# EAGLE design Hornbill  (EAGLE 6.4)
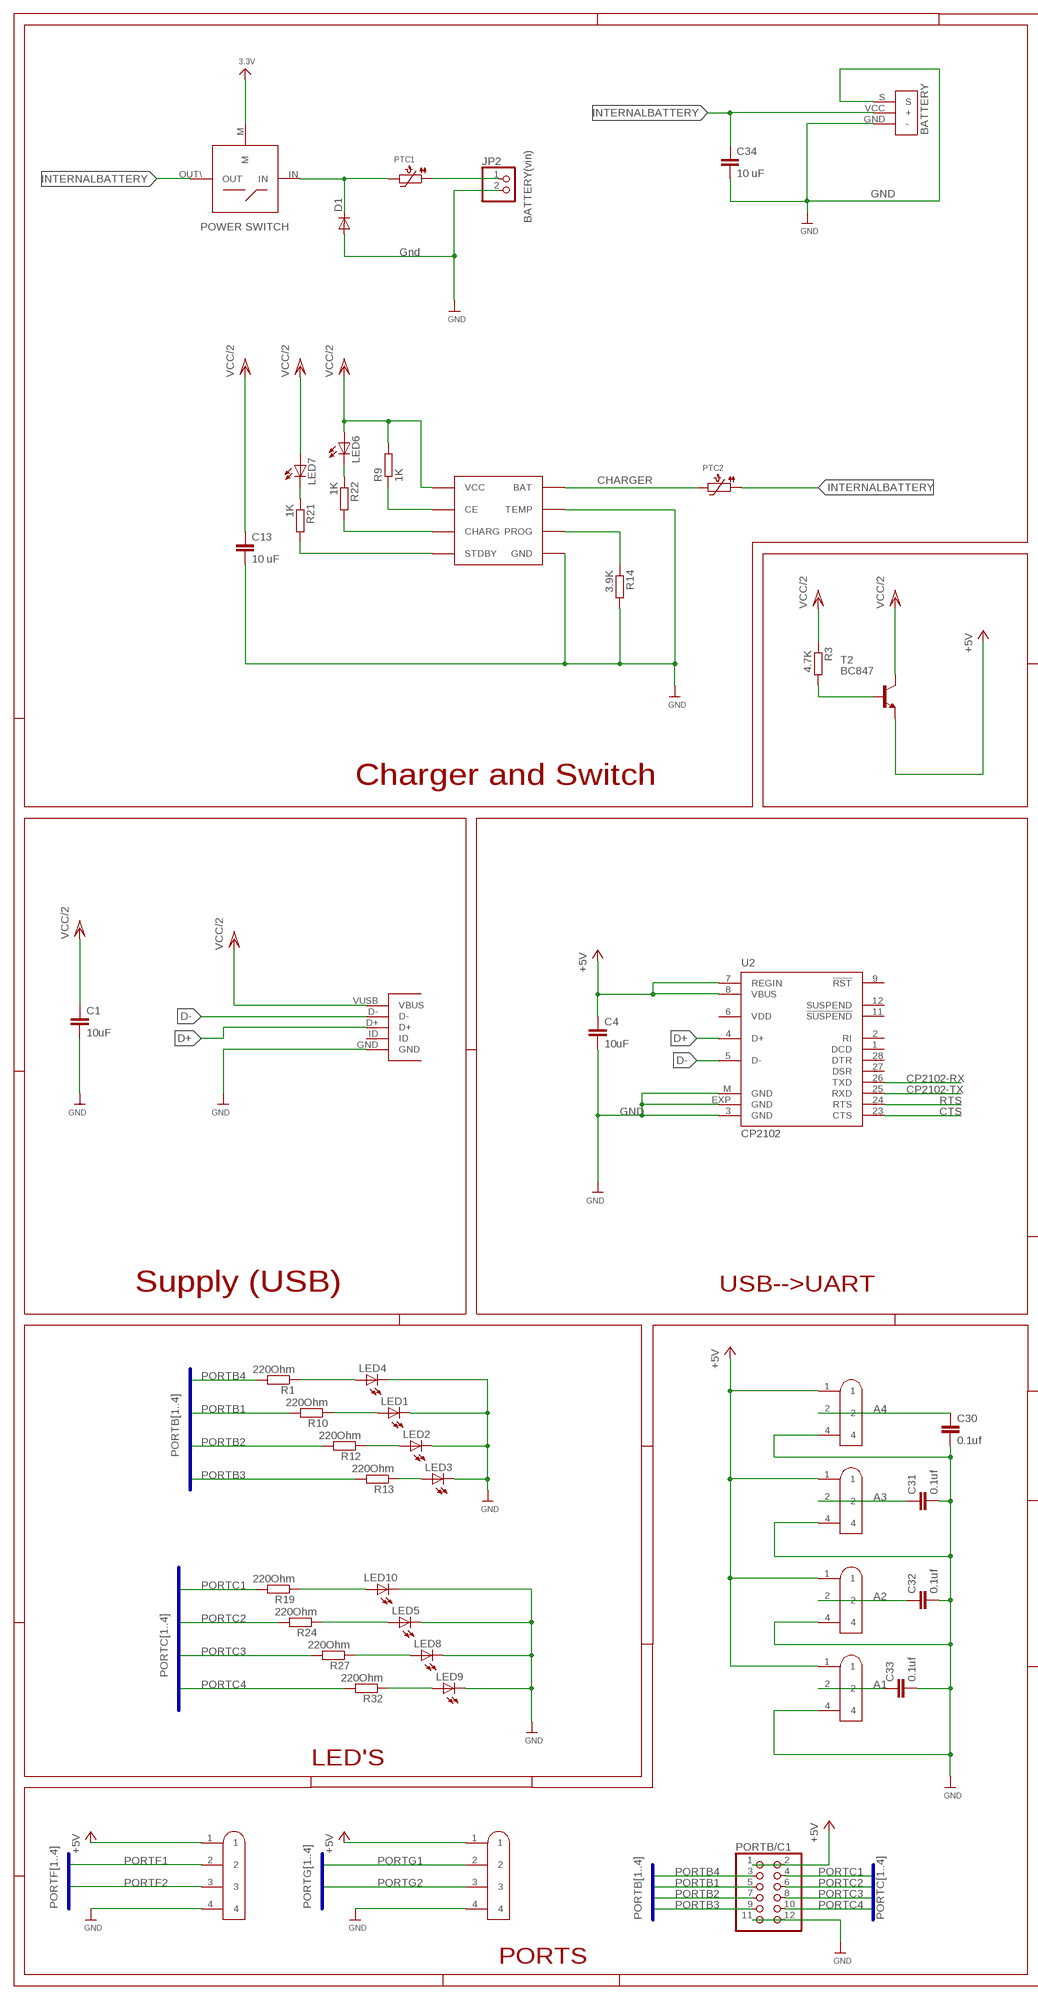
[diagram p0: schematic, sheet 1, part 1 of 2]
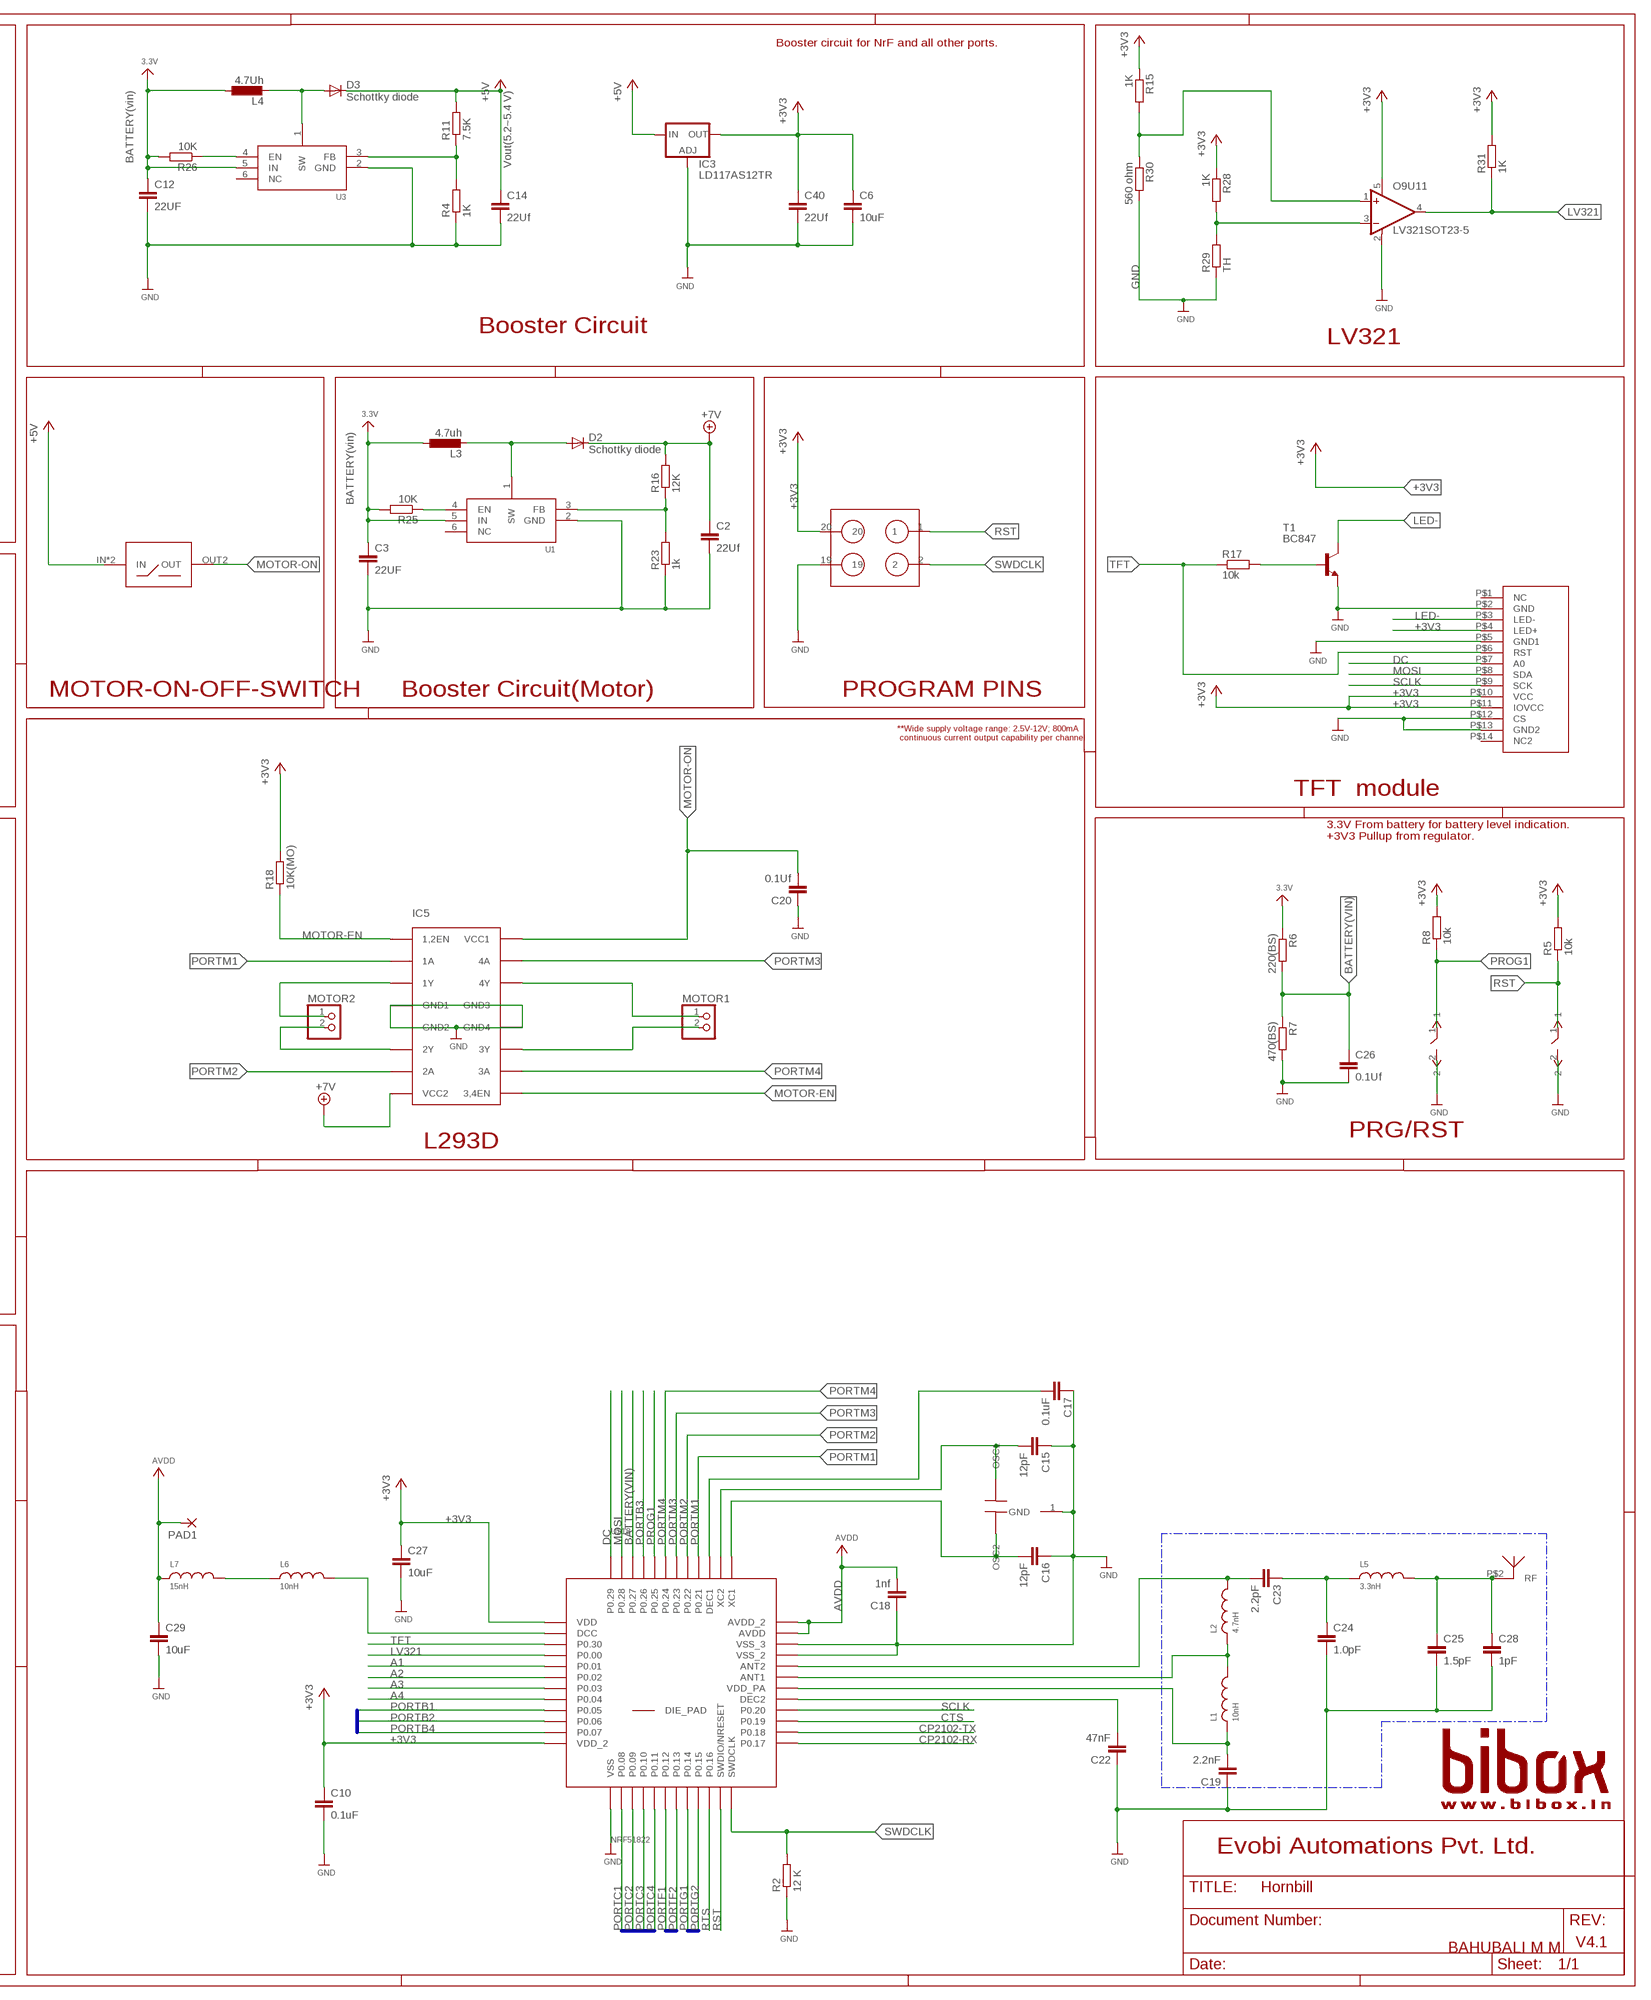
[diagram p1: schematic, sheet 1, part 2 of 2]

## Parts
BATTERY  BS  [BS]
C1  10uF  CAP0603  [0603]
C2  22Uf  C-EUC0603  [C0603]
C3  22UF  C-EUC0603  [C0603]
C4  10uF  CAP0603  [0603]
C6  10uF  C-EUC0603  [C0603]
C10  0.1uF  C-EUC0603  [C0603]
C12  22UF  C-EUC0603  [C0603]
C13  10 uF  C-EUC0603  [C0603]
C14  22Uf  C-EUC0603  [C0603]
C15  12pF  C-EUC0603  [C0603]
C16  12pF  C-EUC0603  [C0603]
C17  0.1uF  C-EUC0603  [C0603]
C18  1nf  C-EUC0603  [C0603]
C19  2.2nF  C-EUC0603  [C0603]
C20  0.1Uf  C-EUC0603  [C0603]
C22  47nF  C-EUC0603  [C0603]
C23  2.2pF  C-EUC0603  [C0603]
C24  1.0pF  C-EUC0603  [C0603]
C25  1.5pF  C-EUC0603  [C0603]
C26  0.1Uf  C-EUC0603  [C0603]
C27  10uF  C-EUC0603  [C0603]
C28  1pF  C-EUC0603  [C0603]
C29  10uF  C-EUC0603  [C0603]
C30  0.1uf  C-EUC0603  [C0603]
C31  0.1uf  C-EUC0603  [C0603]
C32  0.1uf  C-EUC0603  [C0603]
C33  0.1uf  C-EUC0603  [C0603]
C34  10 uF  C-EUC0603  [C0603]
C40  22Uf  C-EUC0603  [C0603]
D1  DIODESMA  [SMA-DIODE]
D2  Schottky diode  DIODESMA  [SMA-DIODE]
D3  Schottky diode  DIODESMA  [SMA-DIODE]
IC2  LT1173CS8  [SOIC8]
IC3  LD117AS12TR  [SOT223]
IC5  L293D  [DIL16]
JP2  PINHD-1X2  [1X02]
L1  10nH  INDUCTOR0603  [0603]
L2  4.7nH  INDUCTOR0603  [0603]
L3  4.7uh  L-EUWE-TPC  [POWER-CHOKE_WE-TPC]
L4  4.7Uh  L-EUWE-TPC  [POWER-CHOKE_WE-TPC]
L5  3.3nH  INDUCTOR0603  [0603]
L6  10nH  INDUCTOR0603  [0603]
L7  15nH  INDUCTOR0603  [0603]
LED1  LEDCHIP-LED0805  [CHIP-LED0805]
LED2  LEDCHIP-LED0805  [CHIP-LED0805]
LED3  LEDCHIP-LED0805  [CHIP-LED0805]
LED4  LEDCHIP-LED0805  [CHIP-LED0805]
LED5  LEDCHIP-LED0805  [CHIP-LED0805]
LED6  LEDCHIP-LED0805  [CHIP-LED0805]
LED7  LEDCHIP-LED0805  [CHIP-LED0805]
LED8  LEDCHIP-LED0805  [CHIP-LED0805]
LED9  LEDCHIP-LED0805  [CHIP-LED0805]
LED10  LEDCHIP-LED0805  [CHIP-LED0805]
MOTOR1  PINHD-1X2  [1X02]
MOTOR2  PINHD-1X2  [1X02]
O9U11  LV321SOT23-5  [SOT23-5]
PAD1  SMD2  [SMD1,27-2,54]
PORTB/C1  PINHD-2X6  [2X06]
PTC1  PTC1206  [1206]
PTC2  PTC1206  [1206]
R1  220Ohm  R-EU_R0603  [R0603]
R2  12 K  R-EU_R0603  [R0603]
R3  4.7K  R-EU_R0603  [R0603]
R4  1K  R-EU_R0603  [R0603]
R5  10k  R-EU_R0603  [R0603]
R6  220(BS)  R-EU_R0603  [R0603]
R7  470(BS)  R-EU_R0603  [R0603]
R8  10k  R-EU_R0603  [R0603]
R9  1K  R-EU_R0603  [R0603]
R10  220Ohm  R-EU_R0603  [R0603]
R11  7.5K  R-EU_R0603  [R0603]
R12  220Ohm  R-EU_R0603  [R0603]
R13  220Ohm  R-EU_R0603  [R0603]
R14  3.9K  R-EU_R0603  [R0603]
R15  1K  R-EU_R0603  [R0603]
R16  12K  R-EU_R0603  [R0603]
R17  10k  R-EU_R0603  [R0603]
R18  10K(MO)  R-EU_R0603  [R0603]
R19  220Ohm  R-EU_R0603  [R0603]
R21  1K  R-EU_R0603  [R0603]
R22  1K  R-EU_R0603  [R0603]
R23  1k  R-EU_R0603  [R0603]
R24  220Ohm  R-EU_R0603  [R0603]
R25  10K  R-EU_R0603  [R0603]
R26  10K  R-EU_R0603  [R0603]
R27  220Ohm  R-EU_R0603  [R0603]
R28  1K  R-EU_R0603  [R0603]
R29  TH  R-EU_R0805  [R0805]
R30  560 ohm  R-EU_R0603  [R0603]
R31  1K  R-EU_R0603  [R0603]
R32  220Ohm  R-EU_R0603  [R0603]
RST  NANOSMD\  [NANOSMD]
T1  BC847  [SOT23]
T2  BC847  [SOT23]
U1  MIC5320  [SOT23-6]
U2  CP2102  CP210X_USB_UART  [MLP28]
U3  MIC5320  [SOT23-6]
U$4  CRYSTAL8MHZ  [8MHZ]
U$6  10X2  [10X2]
U$8  SWITCH  [3PINSWITCH@1]
U$9  SWITCH  [3PINSWITCH]
U$18  NRF51822  [QFN48]
U$19  3.5MM-JACK  [3.5MM-JACK]
U$20  3.5MM-JACK  [3.5MM-JACK]
U$26  LCDDISPLAY1CHAINA  [LCDDISPLAY1]
U$27  NANOSMD\  [NANOSMD]
U$28  3.5MM-JACK  [3.5MM-JACK]
U$32  3.5MM-JACK  [3.5MM-JACK]
U$34  3.5MM-JACK  [3.5MM-JACK]
U$36  3.5MM-JACK  [3.5MM-JACK]
U$40  WTBT  [BTWT]
U$52  USBMICRO  [USBMICRO]

## Nets
3.3V: C3.1 C12.1 L3.1 L4.1 R6.1 R25.2 R26.2 U1.5(IN) U3.5(IN) U$9.M
+3V3: C6.1 C10.1 C27.1 C40.1 IC3.4(OUT) O9U11.5(V+) R5.2 R8.2 R15.1 R18.2 R28.1 R31.2 U$6.20 U$18.1(VDD) U$18.12(VDD_2) U$26.P$4(LED+) U$26.P$10(VCC) U$26.P$11(IOVCC)
+5V: C4.1 C14.1 D3.C IC3.3(IN) PORTB/C1.1 PORTB/C1.2 R11.2 T2.2(E) U2.7(REGIN) U2.8(VBUS) U$8.IN U$8.OUT1(IN) U$19.1 U$20.1 U$28.1 U$32.1 U$34.1 U$36.1
+7V: C2.1 D2.C IC5.8(VCC2) R16.2
A1: C33.1 U$18.5(P0.01) U$34.2
A2: C32.1 U$18.6(P0.02) U$36.2
A3: C31.1 U$18.7(P0.03) U$32.2
A4: C30.1 U$18.8(P0.04) U$28.2
AVDD: C18.2 C29.1 L7.1 PAD1.1(P) U$18.35(AVDD) U$18.36(AVDD_2)
BATTERY(VIN): C26.1 R6.2 R7.1 U$18.46(P0.27)
CHARGER: IC2.BAT PTC2.2
CP2102-RX: U2.26(TXD) U$18.25(P0.17)
CP2102-TX: U2.25(RXD) U$18.26(P0.18)
CTS: U2.23(CTS) U$18.27(P0.19)
D+: U2.4(D+) U$52.D+
D-: U2.5(D-) U$52.D-
DC: U$18.48(P0.29) U$26.P$7(A0)
INTERNALBATTERY: BATTERY.VCC(+) C34.1 PTC2.1 U$9.OUT\(OUT)
LED-: T1.3(C) U$26.P$3(LED-)
LV321: O9U11.4(OUT) R31.1 U$18.4(P0.00)
MOSI: U$18.47(P0.28) U$26.P$8(SDA)
MOTOR-EN: IC5.1(1,2EN) IC5.9(3,4EN) R18.1
MOTOR-ON: C20.2 IC5.16(VCC1) U$8.OUT2(OUT)
N$2: D2.A L3.2 U1.1(SW)
N$4: IC2.CE R9.1
N$6: JP2.1 PTC1.1
N$8: C17.2 U$18.39(DEC1)
N$11: R16.1 R23.2 U1.3(FB)
N$12: LED3.A R13.1
N$13: LED2.A R12.1
N$14: C16.2 U$4.OSC2 U$18.37(XC1)
N$15: D3.A L4.2 U3.1(SW)
N$16: LED1.A R10.1
N$17: C23.2 L2.2 U$18.32(ANT2)
N$18: L1.2 L2.1 U$18.31(ANT1)
N$19: R4.2 R11.1 U3.3(FB)
N$20: C23.1 C24.1 L5.1
N$21: C25.1 C28.1 L5.2 U$40.P$2(RF)
N$22: IC5.3(1Y) MOTOR2.1
N$23: C19.2 L1.1 U$18.30(VDD_PA)
N$24: C15.2 U$4.OSC1 U$18.38(XC2)
N$25: C22.2 U$18.29(DEC2)
N$26: L6.2 U$18.2(DCC)
N$27: L6.1 L7.2
N$28: IC5.6(2Y) MOTOR2.2
N$29: LED4.A R1.1
N$30: R17.2 T1.1(B)
N$31: LED9.A R32.1
N$32: IC5.11(3Y) MOTOR1.2
N$33: LED8.A R27.1
N$34: R25.1 U1.4(EN)
N$35: IC5.14(4Y) MOTOR1.1
N$36: LED5.A R24.1
N$37: R26.1 U3.4(EN)
N$38: BATTERY.GND(-) BATTERY.S C1.2 C2.2 C3.2 C4.2 C6.2 C10.2 C12.2 C13.2 C14.2 C15.1 C16.1 C17.1 C18.1 C19.1 C20.1 C22.1 C24.2 C25.2 C26.2 C27.2 C28.2 C29.2 C30.2 C31.2 C32.2 C33.2 C34.2 C40.2 D1.A IC2.GND IC2.TEMP IC3.1(ADJ) IC5.4(GND1) IC5.5(GND2) IC5.12(GND4) IC5.13(GND3) JP2.2 LED1.C LED2.C LED3.C LED4.C LED5.C LED8.C LED9.C LED10.C O9U11.2(V-) PORTB/C1.11 PORTB/C1.12 R2.1 R4.1 R7.2 R14.2 R23.1 R29.1 R30.2 RST.2 T1.2(E) U1.2(GND) U2.3(GND) U2.EXP(GND) U2.M(GND) U3.2(GND) U$4.1(GND) U$6.19 U$18.13(VSS) U$18.33(VSS_2) U$18.34(VSS_3) U$19.4 U$20.4 U$26.P$2(GND) U$26.P$5(GND1) U$26.P$12(CS) U$26.P$13(GND2) U$27.2 U$28.4 U$32.4 U$34.4 U$36.4 U$52.GND ; supply symbol labelled GND
N$39: O9U11.3(-IN) R28.2 R29.2
N$40: LED10.A R19.1
N$41: D1.C PTC1.2 U$9.IN
N$42: O9U11.1(+IN) R15.2 R30.1
N$43: R3.2 T2.1(B)
N$44: IC2.STDBY R21.2
N$45: IC2.PROG R14.1
N$47: LED6.C R22.1
N$48: IC2.CHRG(CHARG) R22.2
N$49: LED7.C R21.1
PORTB1: PORTB/C1.5 R10.2 U$18.9(P0.05)
PORTB2: PORTB/C1.7 R12.2 U$18.10(P0.06)
PORTB3: PORTB/C1.9 R13.2 U$18.45(P0.26)
PORTB4: PORTB/C1.3 R1.2 U$18.11(P0.07)
PORTC1: PORTB/C1.4 R19.2 U$18.14(P0.08)
PORTC2: PORTB/C1.6 R24.2 U$18.15(P0.09)
PORTC3: PORTB/C1.8 R27.2 U$18.16(P0.10)
PORTC4: PORTB/C1.10 R32.2 U$18.17(P0.11)
PORTF1: U$18.18(P0.12) U$20.2
PORTF2: U$18.19(P0.13) U$20.3
PORTG1: U$18.20(P0.14) U$19.2
PORTG2: U$18.21(P0.15) U$19.3
PORTM1: IC5.2(1A) U$18.40(P0.21)
PORTM2: IC5.7(2A) U$18.41(P0.22)
PORTM3: IC5.15(4A) U$18.42(P0.23)
PORTM4: IC5.10(3A) U$18.43(P0.24)
PROG1: R8.1 U$18.44(P0.25) U$27.1
RST: R5.1 RST.1 U$6.1 U$18.23(SWDIO/NRESET)
RTS: U2.24(RTS) U$18.22(P0.16)
SCLK: U$18.28(P0.20) U$26.P$9(SCK)
SWDCLK: R2.2 U$6.2 U$18.24(SWDCLK)
TFT: R17.1 U$18.3(P0.30) U$26.P$6(RST)
VCC/2: C1.1 C13.1 IC2.VCC LED6.A LED7.A R3.1 R9.2 T2.3(C) U$52.VUSB(VBUS)
Unconnected: U1.6(NC) U2.1(DCD) U2.2(RI) U2.9(!RST) U2.11(!SUSPEND) U2.12(SUSPEND) U2.27(DSR) U2.28(DTR) U3.6(NC) U$18.GND(DIE_PAD) U$26.P$1(NC) U$26.P$14(NC2) U$52.ID

## Buses
PORTC[1..4]
PORTG[1..4]
PORTB[1..4]
PORTF[1..4]

## Notes on the sheet
- Booster circuit for NrF and all other ports.
- BATTERY(vin)
- BATTERY
- Vout(5.2~5.4 V)
- GND
- POWER SWITCH | BATTERY(vin)
- Gnd
- GND
- Booster Circuit
- LV321
- BATTERY(vin)
- MOTOR-ON-OFF-SWITCH | Booster Circuit(Motor) | PROGRAM PINS
- **Wide supply voltage range: 2.5V-12V; 800mA
   continuous current output capability per channel
- Charger and Switch
- TFT  module
- 3.3V From battery for battery level indication.
  +3V3 Pullup from regulator.
- GND
- PRG/RST
- L293D
- Supply (USB) | USB-->UART
- LED'S
- Evobi Automations Pvt. Ltd.
- V4.1
- BAHUBALI M M
- PORTS

## Power pins joined to a net without a drawn wire
VDD: U2.6(VDD)

## Library data of the parts
BATTERY = BERG STRIP 0.635 mm:BS
C1 C4 = SparkFun:CAP: Capacitor Standard 0603 ceramic capacitor, and 0.1" leaded capacitor.
C2 C3 C6 C10 C12-C20 C22-C34 C40 = rcl:C-EU: CAPACITOR, European symbol
D1-D3 = SparkFun:DIODE: Diode These are standard reverse protection diodes and small signal diodes. SMA package can handle up to about 1A. SOD-323 can handle about 200mA. What the SOD-323 package when ordering, there are some mfgs out there that are 5-pin packages.
IC2 = ltc_swr:LT1173: LT1173 - Micropower DC/DC Converter Adjustable and Fixed 5V, 12V Operates at Supply Voltages From 2.0V to 30V Consumes Only 110µA Supply Current Works in Step-Up or Step-Down Mode Only Three External Components Required Low Battery Detector Comparator On-Chip User-Adjustable Current Limit Internal 1A Power Switch Fixed or Adjustable Output Voltage Versions Space Saving 8-Pin MiniDIP or SO8 Package
IC3 = v-reg:LD117A?*: Low drop fixed and adjustable positive voltage regulators 1 A Source: http://www.st.com/stonline/products/literature/ds/7194/ld1117axx.pdf
IC5 = sgs-thom:L293D
JP2 MOTOR1 MOTOR2 = pinhead:PINHD-1X2: PIN HEADER
L1 L2 L5-L7 = new:INDUCTOR: Inductors 0603: 10nH Ceramic Inductor - microwire antenna/RF (Digikey: 712-1434-2-ND) 0805: 560nH Ceramic Inductor - RF (Digikey: 553-1047-1-ND) 1007 (2518 Metric) SMT: 10µH 10% 250mOhm 820mA 1007 Inductor (Digikey: 587-2189-1-ND) 22µH 10% 500mOhm 580mA 1007 Inductor (Digikey: 587-2190-1-ND) 47µH 10% 950mOhm 420mA 1007 Inductor (Digikey: 587-2191-1-ND) 47µH 5% 100mOhm 1A 1008 Inductor (Digikey: 732-1816-1-ND) 6.0x6.0mm: 4.7µH 20% 3.8A 27mOhm Inductor (Digikey: 445-6538-2-ND)
L3 L4 = rcl edited:L-EU: INDUCTOR, European symbol
LED1-LED10 = led:LED: LED OSRAM: - CHIPLED LG R971, LG N971, LY N971, LG Q971, LY Q971, LO R971, LY R971 LH N974, LH R974 LS Q976, LO Q976, LY Q976 LO Q996 - Hyper CHIPLED LW Q18S LB Q993, LB Q99A, LB R99A - SideLED LS A670, LO A670, LY A670, LG A670, LP A670 LB A673, LV A673, LT A673, LW A673 LH A674 LY A675 LS A676, LA A676, LO A676, LY A676, LW A676 LS A679, LY A679, LG A679 - Hyper Micro SIDELED® LS Y876, LA Y876, LO Y876, LY Y876 LT Y87S - SmartLED LW L88C, LW L88S LB L89C, LB L89S, LG L890 LS L89K, LO L89K, LY L89K LS L896, LA L896, LO L896, LY L896 - TOPLED LS T670, LO T670, LY T670, LG T670, LP T670 LSG T670, LSP T670, LSY T670, LOP T670, LYG T670 LG T671, LOG T671, LSG T671 LB T673, LV T673, LT T673, LW T673 LH T674 LS T676, LA T676, LO T676, LY T676, LB T676, LH T676, LSB T676, LW T676 LB T67C, LV T67C, LT T67C, LS T67K, LO T67K, LY T67K, LW E67C LS E67B, LA E67B, LO E67B, LY E67B, LB E67C, LV E67C, LT E67C LW T67C LS T679, LY T679, LG T679 LS T770, LO T770, LY T770, LG T770, LP T770 LB T773, LV T773, LT T773, LW T773 LH T774 LS E675, LA E675, LY E675, LS T675 LS T776, LA T776, LO T776, LY T776, LB T776 LHGB T686 LT T68C, LB T68C - Hyper Mini TOPLED® LB M676 - Mini TOPLED Santana® LG M470 LS M47K, LO M47K, LY M47K Source: http://www.osram.convergy.de LUXEON: - LUMILED® LXK2-PW12-R00, LXK2-PW12-S00, LXK2-PW14-U00, LXK2-PW14-V00 LXK2-PM12-R00, LXK2-PM12-S00, LXK2-PM14-U00 LXK2-PE12-Q00, LXK2-PE12-R00, LXK2-PE12-S00, LXK2-PE14-T00, LXK2-PE14-U00 LXK2-PB12-K00, LXK2-PB12-L00, LXK2-PB12-M00, LXK2-PB14-N00, LXK2-PB14-P00, LXK2-PB14-Q00 LXK2-PR12-L00, LXK2-PR12-M00, LXK2-PR14-Q00, LXK2-PR14-R00 LXK2-PD12-Q00, LXK2-PD12-R00, LXK2-PD12-S00 LXK2-PH12-R00, LXK2-PH12-S00 LXK2-PL12-P00, LXK2-PL12-Q00, LXK2-PL12-R00 Source: www.luxeon.com KINGBRIGHT: KA-3528ASYC Source: www.kingbright.com
O9U11 = LITTLEBITS:LV321
PAD1 = wirepad:SMD2: SMD PAD
PORTB/C1 = pinhead:PINHD-2X6: PIN HEADER
PTC1 PTC2 = new1:PTC: PTC (Resettable Fuse) 1206 Package 250mA PTC (16V Max, Time-to-Trip: 0.08s) - Digikey: F2110CT-ND 1210 Package 100mA PTC (30V Max, Time-to-Trip: 0.6s) - Digikey: MF-USMF010-2CT-ND 1812 Package 750mA PTC (24V Max, Time-to-Trip: 0.2s) - Digikey: MF-MSMF075/24-2CT-ND
R1-R19 R21-R32 = rcl:R-EU_: RESISTOR, European symbol
RST U$27 = NANO DST Switch:NANOSMD\
T1 T2 = transistor:BC847: NPN TRANSISTOR
U1 U3 = new:MIC5320: MIC5320 - Dual 150mA ULDO Linear Regulator Ultra-low 35mV dropout at 150mA, 2.3-5.5V Input 3.3V/1.8V SOT23-6 (Digikey: 576-1658-1-ND) 3.3V/1.5V SOT23-6 (Digikey: 576-3483-1-ND)
U2 = SparkFun:CP210X_USB_UART: Single-Chip USB to UART Bridge Source: www.silabs.com .. CP2101.pdf / cp2102.pdf. Spark Fun Electronics SKU : COM-00310
U$4 = CRYSTAL16 Mhz:CRYSTAL8MHZ
U$6 = NANO BERGSTRIP 2x2:10X2
U$8 = ploul Switch. for nano bulb:SWITCH
U$9 = ploul Switch:SWITCH
U$18 = NordicSemi:NRF51822: Bluetooth 4.0 Low Energy/2.4Ghz NORDIC SEMICONDUCTOR
U$19 U$20 = 3.5mm jack(4 pole):3.5MM-JACK
U$26 = LCD Display Z144SN005(14 Pins):LCDDISPLAY1CHAINA
U$28 U$32 U$34 U$36 = 3.5mm jack(3 pole):3.5MM-JACK
U$40 = NRF WT-BT-ATENNA:WTBT
U$52 = USB micro female - through hole:USBMICRO

## Board
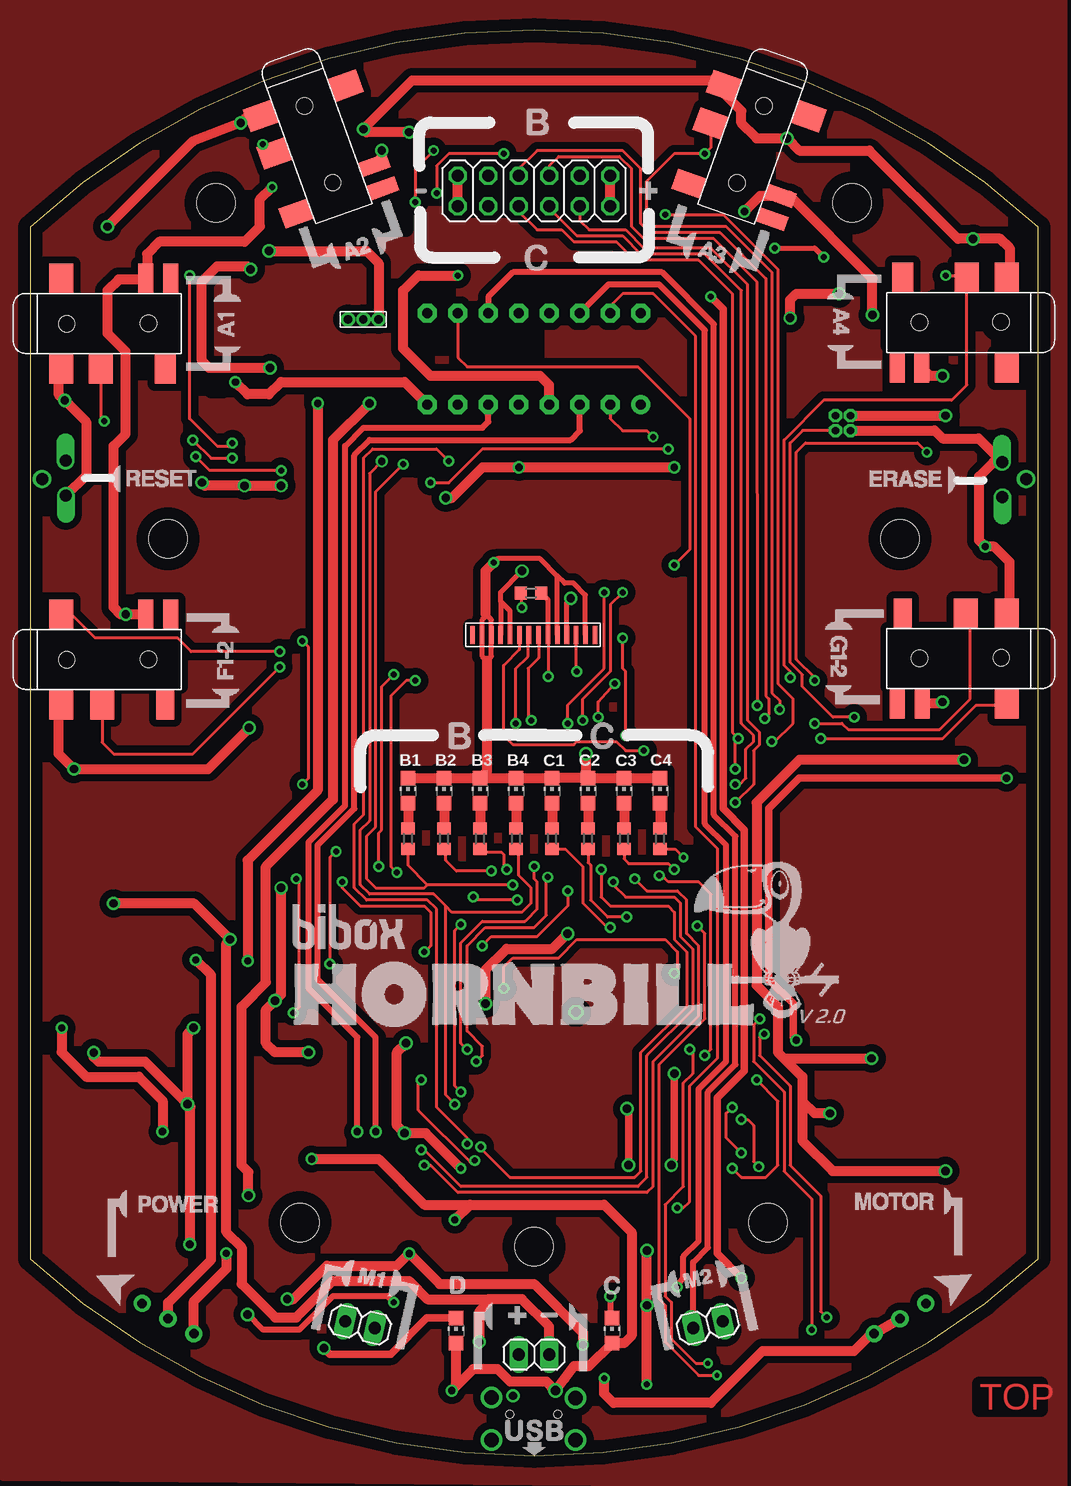
[diagram p2: board, top side]
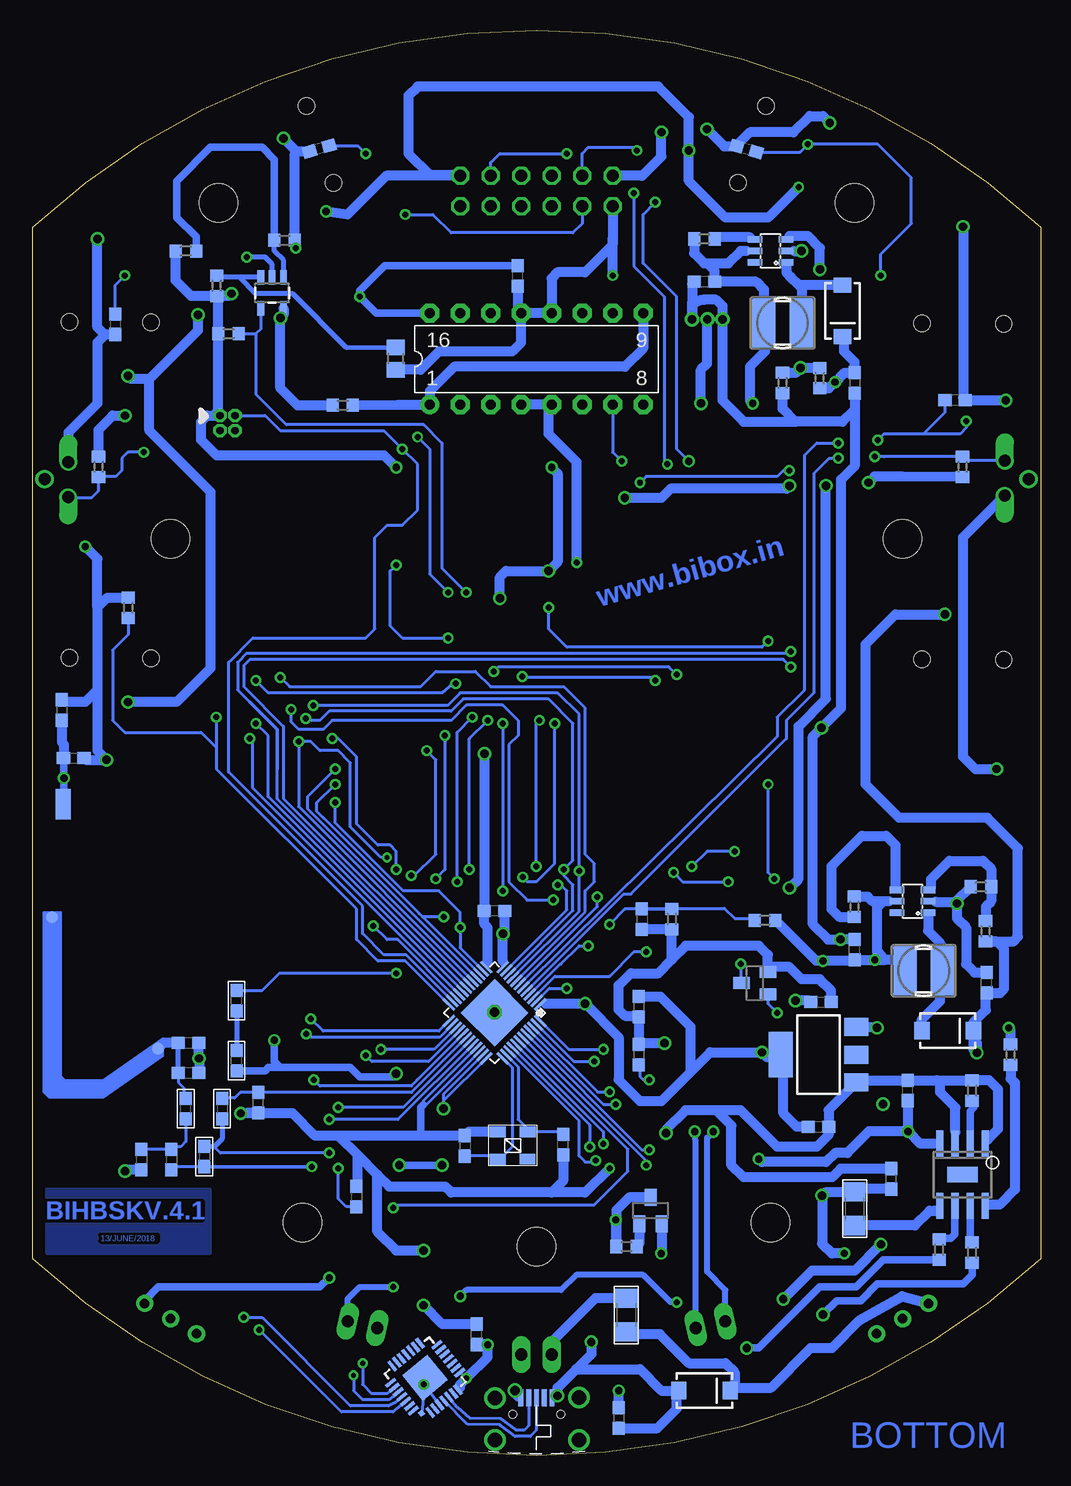
[diagram p3: board, bottom side, seen from below]

Size 84 x 118.84 mm. Coordinates in mm from the lower left corner, seen from the top.
Outline: 0,102.42 0,16.42 arc85 84,16.42 84,102.42 arc85 0,102.42
Copper layers (1*16): Top 0.035mm / dielectric 1.5mm / Bottom 0.035mm
Design rules "default *": minimum track width 10mil, minimum drill 22mil, track to track 8mil, track to pad 8mil, pad to pad 8mil, via to via 8mil, smd to smd 8mil, copper to edge 40mil, drill to drill 8mil, minimum pad ring 10mil, minimum via ring 8mil, stop-mask expansion 4mil, vias tented up to drill 35mil, thermal gap 10mil
Holes 3.2 mm at 22.5,19.42 61.5,19.42 68.5,104.42 15.5,104.42 42,17.42 11.5,76.42 72.5,76.42
tRestrict: area 50.4,19.8 to 51.4,20.7; area 41.2,1.3 to 42.8,4.8; area 42.7,0.7 to 44.2,2.6; area 40,1 to 41.2,2.6; area 46.1,5.6 to 46.9,6.6; area 30.1,24.4 to 31.9,25.9; area 32.8,21.9 to 33.8,23.2; area 38.5,10.3 to 41.2,11.9; area 38.4,8.3 to 39.5,11.8; area 30.1,10.7 to 31.6,12.2; area 31.5,11.8 to 32.3,12.7; area 9.1,10.3 to 10.3,11.3; area 11.1,8.9 to 12.6,10.2; area 58.2,19.5 to 59.7,22.7; area 59.6,21.5 to 60.4,22.7; area 71.3,8.7 to 72.9,10; area 73.9,10.1 to 74.8,11.3; area 31.8,32.2 to 33.2,33.8; area 44,48.2 to 45.1,49.7; area 32.6,49.1 to 33.2,50.2; area 33.1,48.3 to 34.5,49.2; area 32.6,52.7 to 33.3,53.8; area 35.7,52.2 to 36.2,53.7; area 38.6,52.5 to 39.5,53.8; area 41.5,52.4 to 42.6,53.8; area 44.6,52.4 to 45.4,53.8; area 47.3,52.3 to 48.5,53.9; area 50.5,52.8 to 51.5,53.9; area 39,57.4 to 45.3,58.6; area 47.3,57.3 to 49.3,58.5; area 21.6,48.8 to 22.8,50.4; area 44.3,63.4 to 45.1,64.7; area 42.6,62.7 to 43.1,64.2; area 42.8,59.8 to 43.8,61.9; area 43.7,65.3 to 45,67.1; area 45.9,65.9 to 47.3,67.2; area 78.8,63 to 80.3,65.7; area 82.2,64.6 to 83.2,68.4; area 1,64.5 to 1.9,68; area 1.3,85.5 to 2.1,87.4; area 0.6,92.5 to 2,96.5; area 81.5,75.8 to 83.2,77.7; area 82,92.3 to 84,96.3; area 82.1,101.7 to 83,102.6; area 63.3,101.5 to 64.9,102.4; area 63.3,97.7 to 65.1,99.7; area 65.5,97.8 to 68.6,98.8; area 44.3,105.2 to 45,105.9; area 39.2,105 to 39.9,105.8; area 22.1,104.9 to 23.8,106.4; area 20.5,113 to 21.6,114; area 22.4,114.1 to 24,115.1; area 60.1,113.1 to 63.6,114.9; area 71.5,64.1 to 77.8,68.9; area 79.1,67.6 to 80.9,68.7; area 3.7,64.1 to 12.5,67.4; area 4.4,88.2 to 5.2,88.7; area 75.3,92.3 to 77.6,96.6; area 71.5,92.5 to 73,96.4; area 58,107.5 to 59.5,109.6; area 59.5,106.5 to 61.6,108.3; area 56.7,104 to 57.8,105.5; area 24.5,111.1 to 25.8,112.4; area 24,104 to 27.3,104.7; area 26.5,104.5 to 27.5,106; area 61.8,111.6 to 63.1,112.6; area 59.3,29.3 to 60.3,30.6; area 60,28 to 61.6,30.1; area 52.4,104.5 to 52.9,105.5; area 53.2,104.2 to 54.2,104.7; area 56.2,106.5 to 57.5,107.8; area 15.1,88.7 to 16.1,89.7; area 11.8,92.3 to 12.5,96.4; area 7.5,94.8 to 9,96.6; area 4.2,92.5 to 5.2,93.6; area 9,90.3 to 10,92.5; area 3.7,95.1 to 5.4,96.4; area 41.5,105 to 42.5,105.7; area 28.8,102.2 to 31.3,104; area 24.7,101.4 to 28.3,103.2; area 22.7,101.9 to 24.5,102.2; area 30.8,107.8 to 31.9,109.3; area 26.5,111.6 to 27.8,112.9; area 22.5,107.8 to 26,110.6; area 26.5,108.3 to 27.8,109.3; area 53.5,17.9 to 55,19.4; area 62,21.9 to 63,22.9; area 52.5,5.9 to 53.5,7.9; area 53.5,5.4 to 54.5,6.4; area 36.7,22.9 to 37.2,23.4; area 37.5,22.9 to 38.5,23.9; area 17.5,39.4 to 18.5,39.9; area 17,39.4 to 18,40.4; area 51,43.9 to 53,44.9; area 45,44.4 to 46,45.4; area 46,43.9 to 47,44.4; area 55.5,48.4 to 56.5,50.4; area 60.8,57.2 to 62.3,58.5; area 63.3,59 to 64.9,60; area 32.1,82.1 to 33.9,83.1; area 29.6,86.4 to 31.3,88.2; area 25,86.7 to 26.5,88.2; area 39.2,85.4 to 44.8,86.4; area 44.6,88.7 to 50.6,90; area 33.6,96.1 to 34.9,97.4; area 40.5,96.6 to 46.1,97.6; area 54.5,97.6 to 56,98.9; area 36.7,91.3 to 42.3,93.8; area 32.6,92.3 to 34.9,93.8; area 68.9,107 to 69.7,107.8; area 78.8,95.3 to 79.9,96.4; area 13.1,99.1 to 14.8,100.4; area 3.7,58.3 to 5.2,61; area 46.8,84.7 to 47.6,86.7; area 52.2,85.7 to 53.7,87.5; area 53.4,84.9 to 54.2,86.2; area 49.2,6.2 to 50.2,8.2
bRestrict: area 75.3,20.3 to 75.4,20.5

### Footprints (pad centres in the part's own frame; a part is rotated, then mirrored left to right if it is on the bottom)
BS = drill 0.7 pad 1: GND 1.272,0; S -1.27,0; VCC -0.002,0
0603 = smd 1.1 x 1: 1 -0.85,0; 2 0.85,0
C0603 = smd 1.1 x 1: 1 -0.85,0; 2 0.85,0
SMA-DIODE = smd 1.27 x 1.47: A -2.15,0; C 2.15,0
SOIC8 = smd 0.6 x 2.2: BAT 1.905,2.6; CE -1.905,2.6; CHRG -0.635,2.6; GND 0.635,-2.6; PROG -0.635,-2.6; STDBY 0.635,2.6; TEMP -1.905,-2.6; VCC 1.905,-2.6 | smd 2.54 x 1.27: P$1 0,0
SOT223 = smd 1.5 x 2: 1 -2.3,-3.15; 2 0,-3.15; 3 2.3,-3.15 | smd 3.8 x 2: 4 0,3.15
DIL16 = drill 0.813 pad 1.6: 1 -8.89,-3.81 | drill 0.813 pad 1.6 octagon: 2 -6.35,-3.81; 3 -3.81,-3.81; 4 -1.27,-3.81; 5 1.27,-3.81; 6 3.81,-3.81; 7 6.35,-3.81; 8 8.89,-3.81; 9 8.89,3.81; 10 6.35,3.81; 11 3.81,3.81; 12 1.27,3.81; 13 -1.27,3.81; 14 -3.81,3.81; 15 -6.35,3.81; 16 -8.89,3.81
1X02 = drill 1.016 long: 1 -1.27,0; 2 1.27,0
POWER-CHOKE_WE-TPC = smd 4.3 x 2: 1 0,1.55; 2 0,-1.55
CHIP-LED0805 = smd 1.2 x 1.2: A 0,-1.05; C 0,1.05
SOT23-5 = smd 0.55 x 1.2: 1 -0.95,-1.3; 2 0,-1.3; 3 0.95,-1.3; 4 0.95,1.3; 5 -0.95,1.3
SMD1,27-2,54 = smd 1.27 x 2.54: 1 0,0
2X06 = drill 1.016 octagon: 1 -6.35,-1.27; 2 -6.35,1.27; 3 -3.81,-1.27; 4 -3.81,1.27; 5 -1.27,-1.27; 6 -1.27,1.27; 7 1.27,-1.27; 8 1.27,1.27; 9 3.81,-1.27; 10 3.81,1.27; 11 6.35,-1.27; 12 6.35,1.27
1206 = smd 1.6 x 1.8: 1 -1.4,0; 2 1.4,0
R0603 = smd 1 x 1.1: 1 -0.85,0; 2 0.85,0
R0805 = smd 1.3 x 1.5: 1 -0.95,0; 2 0.95,0
NANOSMD = drill 1 pad 1.422 offset: 1 -1.519,-0.026; 2 1.401,-0.006 | drill 1: P$3 0,-2
SOT23 = smd 1 x 1.4: 1 -0.95,-1.1; 2 0.95,-1.1; 3 0,1.1
SOT23-6 = smd 0.55 x 1.2: 1 -0.95,-1.3; 2 0,-1.3; 3 0.95,-1.3; 4 0.95,1.3; 5 0,1.3; 6 -0.95,1.3
MLP28 = smd 1 x 0.3: 1 -2.5,1.5; 2 -2.5,1; 3 -2.5,0.5; 4 -2.5,0; 5 -2.5,-0.5; 6 -2.5,-1; 7 -2.5,-1.5; 15 2.5,-1.5; 16 2.5,-1; 17 2.5,-0.5; 18 2.5,0; 19 2.5,0.5; 20 2.5,1; 21 2.5,1.5 | smd 0.3 x 1: 8 -1.5,-2.5; 9 -1,-2.5; 10 -0.5,-2.5; 11 0,-2.5; 12 0.5,-2.5; 13 1,-2.5; 14 1.5,-2.5; 22 1.5,2.5; 23 1,2.5; 24 0.5,2.5; 25 0,2.5; 26 -0.5,2.5; 27 -1,2.5; 28 -1.5,2.5 | smd 2.7 x 2.7: EXP 0,0 | smd 0.435 x 0.435: M -2.103,2.103
8MHZ = smd 1.3 x 0.9: 1 -1.235,1.075; 2 1.255,-1.205; OSC1 1.265,1.075; OSC2 -1.235,-1.215
10X2 = drill 0.6 pad 0.8 octagon: 1 -0.64,0.57; 2 -0.64,-0.68; 19 0.61,-0.68; 20 0.61,0.57
3PINSWITCH = drill 0.8 pad 1.422: IN 0,0; OUT1 2.5,0; OUT2 -2.5,0
3PINSWITCH' = drill 0.8 pad 1.422: IN -2.5,0; M 0,0; OUT\ 2.5,0
QFN48 = smd 1.3 x 0.226: 1 -3.17,2.2; 2 -3.17,1.8; 3 -3.17,1.4; 4 -3.17,1; 5 -3.17,0.6; 6 -3.17,0.2; 7 -3.17,-0.2; 8 -3.17,-0.6; 9 -3.17,-1; 10 -3.17,-1.4; 11 -3.17,-1.8; 12 -3.17,-2.2; 25 3.17,-2.2; 26 3.17,-1.8; 27 3.17,-1.4; 28 3.17,-1; 29 3.17,-0.6; 30 3.17,-0.2; 31 3.17,0.2; 32 3.17,0.6; 33 3.17,1; 34 3.17,1.4; 35 3.17,1.8; 36 3.17,2.2 | smd 0.226 x 1.3: 13 -2.2,-3.17; 14 -1.8,-3.17; 15 -1.4,-3.17; 16 -1,-3.17; 17 -0.6,-3.17; 18 -0.2,-3.17; 19 0.2,-3.17; 20 0.6,-3.17; 21 1,-3.17; 22 1.4,-3.17; 23 1.8,-3.17; 24 2.2,-3.17; 37 2.2,3.17; 38 1.8,3.17; 39 1.4,3.17; 40 1,3.17; 41 0.6,3.17; 42 0.2,3.17; 43 -0.2,3.17; 44 -0.6,3.17; 45 -1,3.17; 46 -1.4,3.17; 47 -1.8,3.17; 48 -2.2,3.17 | smd 4 x 4: GND 0,0
3.5MM-JACK = smd 1.25 x 2.5: 1 4.065,3.71; NOC 6.115,3.71 | smd 2 x 2.5: 2 0.415,-3.79; 3 -2.985,3.71; 4 -2.985,-3.79 | smd 1.5 x 2.5: NC 5.665,-3.79 | hole 1.35: -2.535,-0.09; 4.265,-0.04
LCDDISPLAY1 = smd 0.38 x 1.5: P$1 -5.07,0; P$2 -4.29,0; P$3 -3.51,0; P$4 -2.73,0; P$5 -1.95,0; P$6 -1.17,0; P$7 -0.39,0; P$8 0.44,0; P$9 1.22,0; P$10 2,0; P$11 2.78,0; P$12 3.56,0; P$13 4.34,0; P$14 5.12,0
3.5MM-JACK' = smd 1.25 x 2.5: 1 4.065,3.71; NOC 6.115,3.71 | smd 2 x 2.5: 2 0.315,-3.79; 3 -2.985,3.71; 4 -2.985,-3.79 | smd 1.75 x 2.5: NC 5.665,-3.79 | hole 1.35: -2.535,-0.09; 4.265,-0.04
BTWT = smd 1 x 1 rotated 304.9: P$1 13.56,8.76; P$2 2.61,-0.06
USBMICRO = smd 0.4 x 1.4: D+ 0.04,-3.66; D- 0.69,-3.66; GND -1.26,-3.66; ID -0.61,-3.66; VUSB 1.34,-3.66 | drill 1.2: P$1 3.5,-3.65; P$7 3.5,-0.15; P$9 -3.5,-3.7; P$10 -3.5,-0.15 | hole 0.65: 2,-2.3; -2,-2.3

### Placement (x,y rotation side)
BATTERY  27.77,94.72 180 top
C1  35.15,3.13 270 bottom
C2  15.5,89.42 270 bottom
C3  28,97.85 180 bottom
C4  47,10.11 90 bottom
C6  18.3,37.82 0 bottom
C10  33.5,37.42 270 bottom
C12  15.5,42.18 90 bottom
C13  11.05,30.44 90 bottom
C14  4.5,39.42 90 bottom
C15  39.78,25.92 90 bottom
C16  47.97,25.82 270 bottom
C17  33.5,33.42 270 bottom
C18  81.56,62.15 270 bottom
C19  65.18,29.42 90 bottom
C20  43.56,98.35 90 bottom
C22  57.01,21.59 270 bottom
C23  72.43,24.68 270 bottom
C24  74.92,24.68 270 bottom
C25  71,31.92 0 bottom
C26  33.22,44.72 270 bottom
C27  45.5,45.42 180 bottom
C28  71,34.42 0 bottom
C29  80.56,58.15 0 bottom
C30  77.12,94.31 270 bottom
C31  60.1,108.95 196.4 bottom
C32  24.5,108.91 163.6 bottom
C33  7.11,88 0 bottom
C34  12.44,23.07 90 bottom
C40  18.5,27.42 0 bottom
D1  28,5.42 0 bottom
D2  16.5,95.42 270 bottom
D3  7.74,35.42 0 bottom
IC2  6.5,23.42 180 bottom
IC3  18.5,33.42 90 bottom
IC5  42,91.42 0 bottom
JP2  42,8.42 0 top
L1  68.21,28.92 270 bottom
L2  69.68,24.94 270 bottom
L3  21.5,94.42 90 bottom
L4  9.74,40.42 90 bottom
L5  71.22,28.92 90 bottom
L6  67,37.92 90 bottom
L7  67,32.92 90 bottom
LED1  34.5,55.42 0 top
LED2  37.5,55.42 0 top
LED3  40.5,55.42 0 top
LED4  31.5,55.42 0 top
LED5  46.5,55.42 0 top
LED6  48.5,10.42 0 top
LED7  35.5,10.42 0 top
LED8  49.5,55.42 0 top
LED9  52.5,55.42 0 top
LED10  43.5,55.42 0 top
MOTOR1  56.5,10.92 193 top
MOTOR2  27.5,10.92 167 top
O9U11  64.03,96.93 180 bottom
PAD1  81.45,54.29 0 bottom
PORTB/C1  42,105.42 180 top
PTC1  34.52,11.72 270 bottom
PTC2  15.5,20.58 270 bottom
R1  31.5,51.42 270 top
R2  76.02,70.68 270 bottom
R3  34.5,17.42 0 bottom
R4  4.98,47.42 0 bottom
R5  6.5,82.42 270 bottom
R6  22.96,44.63 180 bottom
R7  30.72,44.72 270 bottom
R8  78.5,82.42 90 bottom
R9  2.5,33.42 90 bottom
R10  34.5,51.42 270 top
R11  4.58,43.71 270 bottom
R12  37.5,51.42 270 top
R13  40.5,51.42 270 top
R14  5.71,30.42 90 bottom
R15  71.22,100.42 0 bottom
R16  18.41,89.83 270 bottom
R17  41.75,71.9 180 top
R18  58.15,87.57 180 bottom
R19  43.5,51.42 270 top
R21  8.45,17.17 90 bottom
R22  5.71,16.91 90 bottom
R23  21.5,89.42 90 bottom
R24  46.5,51.42 270 top
R25  28.02,101.42 180 bottom
R26  15.51,45.76 90 bottom
R27  49.5,51.42 270 top
R28  68.66,97.52 90 bottom
R29  53.72,91.45 90 bottom
R30  62.99,101.31 0 bottom
R31  67.66,93.52 180 bottom
R32  52.5,51.42 270 top
RST  3,81.42 270 top
T1  23.82,39.39 90 bottom
T2  32.5,20.42 0 bottom
U1  22.5,100.42 90 bottom
U2  51.28,6.49 129.3 bottom
U3  10.67,46.21 90 bottom
U$4  44,25.92 0 bottom
U$6  67.76,86.13 0 top
U$8  SWITCH  [3PINSWITCH]  72.5,11.42 210.2 top
U$9  SWITCH  [3PINSWITCH']  11.5,11.42 329.8 top
U$18  45.5,36.92 225 bottom
U$19  78.4,66.42 180 top
U$20  5.6,66.42 0 top
U$26  42,68.42 180 top
U$27  81,81.42 90 top
U$28  3.5MM-JACK  [3.5MM-JACK']  78.39,94.41 180 top
U$32  3.5MM-JACK  [3.5MM-JACK']  60.39,110.09 250.4 top
U$34  3.5MM-JACK  [3.5MM-JACK']  5.6,94.42 0 top
U$36  3.5MM-JACK  [3.5MM-JACK']  23.82,110.14 289.8 top
U$40  73.6,31.32 90 bottom
U$52  41.97,1.15 180 bottom

### Tracks (layer width: path | path; a pad name or v marks a point on that pad's centre or on a via)
3.3V  (via drill 0.6)
  Top 0.813: U$9.M 11.5,12.75 15.09,16.34 15.09,40.06 v13.82,41.33 | v18.14,41.25 18.14,49.62 23.98,55.46 v23.98,87.72
  Bottom 0.305: U3.5 12.61,46.21 12.61,46.2 | U1.5 24.48,100.42 24.49,100.42
  Bottom 0.61: 23.05,97.2 22.96,97.2 | 22.96,93.81 23.05,93.81 L3.1
  Bottom 0.813: 11.29,40.05 L4.1 12.2,41.33 12.95,41.33 | 12.61,46.2 13.12,46.2 | 13.12,46.2 14.01,46.2 14.39,46.58 15.48,46.58 R26.2 | v13.82,41.33 C12.1 15.58,41.25 v18.14,41.25 18.71,41.25 22.08,44.63 R6.1 | v13.82,41.33 12.95,41.33 | 12.95,41.33 13.21,41.59 | 13.21,41.59 13.63,42.01 13.63,45.69 13.12,46.2 | 24.49,100.42 24.99,100.42 26.01,99.4 27.79,99.4 | R25.2 28.87,100.22 28.04,99.4 27.79,99.4 | 27.79,99.4 27.15,98.77 C3.1 23.7,97.85 23.05,97.2 L3.1 | v13.82,41.33 13.46,41.33 13.21,41.59 | 22.96,93.81 22.96,92.03 24.23,90.76 24.23,87.97 v23.98,87.72
+3V3  (via drill 0.6, 0.7)
  Top 0.406: 39.22,71.21 U$26.P$11 | U$26.P$10 40,70.42 39.22,71.21 | 39.22,71.21 39.22,71.97 v41,73.75 | U$26.P$4 44.73,71.13 v45.06,71.46
  Top 0.813: U$6.20 v76.3,86.7 | v37.95,37.68 37.95,40.47 39.73,42.25 43.54,42.25 v44.81,43.52 | v23.22,33.61 20.42,33.61 19.66,34.38 19.66,37.17 v20.42,37.93 20.93,38.44 v20.93,47.33 | v63.35,94.83 63.35,96.35 63.86,96.86 v67.41,96.86 | v20.93,80.86 v17.88,80.86 14.58,80.86 v14.33,81.11 | v34.65,79.84 35.15,79.84 37.69,82.38 v40.74,82.38 v53.7,82.38
  Bottom 0.254: U$18.1 41.63,37.68 41.25,37.68 | U$18.12 44.81,40.97 44.81,40.98 44.81,41.23
  Bottom 0.406: 41.25,73.49 v41,73.75
  Bottom 0.813: C10.1 31.68,38.27 29.18,35.77 29.18,31.96 | R28.1 70.78,96.67 72.07,97.96 R15.1 | 41.25,37.68 v37.95,37.68 35.15,34.88 35.15,31.33 33.38,29.55 31.6,29.55 29.18,31.96 | 44.81,41.23 v44.81,43.52 44.65,43.68 C27.1 44.55,45.32 | R5.2 11.55,81.62 13.82,81.62 v14.33,81.11 | R8.2 78.5,85.52 77.32,86.7 v76.3,86.7 | C40.1 20.33,27.42 21.44,28.53 21.44,33.21 | 21.44,33.21 IC3.4 | 29.18,31.96 27.53,33.61 v23.22,33.61 22.81,33.21 21.44,33.21 | v17.88,80.86 17.88,63.08 20.17,60.79 20.17,48.09 v20.93,47.33 | R28.1 68.51,96.52 R31.2 68.51,87.14 68.66,86.99 U$6.20 69.44,86.7 69.95,86.19 69.95,84.67 68.68,83.4 54.71,83.4 v53.7,82.38 | O9U11.5 63.08,95.09 v63.35,94.83 63.35,88.99 61.93,87.57 R18.2 | v67.41,96.86 67.6,96.67 R28.1 | C6.1 19.26,37.93 v20.42,37.93 | v45.06,71.46 45.06,73.24 44.55,73.75 v41,73.75 40.23,74.51 40.23,81.87 v40.74,82.38 | v20.93,80.86 21.18,80.6 30.84,80.6 31.6,79.84 v34.65,79.84
+5V  (via drill 0.5, 0.6, 0.7)
  Top 0.61: 62.04,105.5 U$32.1
  Top 0.813: PORTB/C1.2 PORTB/C1.1 | U$36.1 29.31,108.2 v29.31,108.8 | v59.54,103.72 60.83,105.01 U$32.1 63.32,105.01 70.21,98.13 v70.21,95.08 | 74.27,91.27 74.27,90.76 U$28.1 75.03,90 v76.05,90 | 74.27,62.65 U$19.1 75.94,62.71 v76.05,62.82 | U$20.1 v7.98,70.13 7.53,70.13 6.96,70.7 6.96,84.16 7.98,85.18 7.98,92.03 6.45,93.56 6.45,97.11 7.38,98.04 9.66,98.04 U$34.1 9.75,98.22 9.75,100.16 10.77,101.18 17.88,101.18 19.15,102.45 19.15,104.73 v20.17,105.75 | v13.12,29.31 13.37,29.06 13.37,17.68 v13.31,17.61 | v13.63,35.66 13.12,35.15 v13.12,29.31 | v47.85,6.44 47.85,5.17 48.62,4.4 56.74,4.4 61.06,8.72 68.68,8.72 70.12,10.16 U$8.OUT1 U$8.IN | v21.44,13.04 21.95,13.04 24.74,15.83 30.58,15.83 v31.6,16.85 34.14,14.31 42.01,14.31 46.08,10.25 v46.08,9.23 | v5.31,33.58 5.31,33.23 5.69,32.85 9.58,32.85 v13.12,29.31
  Bottom 0.254: U2.7 48.36,5.67 | U2.8 48.33,6.91 v47.85,6.44
  Bottom 0.813: IC3.3 13.69,35.72 v13.63,35.66 | v59.54,103.72 57.76,103.46 54.53,106.69 PORTB/C1.1 48.42,106.77 50.9,106.77 52.68,108.54 52.68,113.37 51.92,114.13 31.85,114.13 29.31,111.59 v29.31,108.8 29.31,106.26 26.26,103.21 22.71,103.21 v20.17,105.75 | 74.27,89.75 70.21,93.81 v70.21,95.08 | 74.27,89.75 74.27,85.43 69.19,80.35 69.19,65.62 71.98,62.82 v76.05,62.82 | 74.27,89.75 75.79,89.75 v76.05,90 | v7.98,70.13 12.1,70.13 14.58,67.65 14.58,55.97 11.79,53.17 4.42,53.17 1.88,50.63 1.88,43.27 2.28,42.86 R11.2 3.67,42.86 3.02,42.22 3.02,38.92 3.37,38.57 C14.1 4.55,38.52 4.55,37.14 5.59,36.1 D3.C 5.59,33.86 v5.31,33.58 5.31,34.37 | 48.36,5.67 48.36,5.93 v47.85,6.44 46.08,8.21 v46.08,9.23 46.11,9.26 C4.1 | v21.44,13.04 19.06,15.42 15.5,15.42 v13.31,17.61 | T2.2 31.55,16.9 v31.6,16.85
+7V  (via drill 0.6)
  Top 0.813: v17.12,89.49 18.14,88.48 19.91,88.48 20.93,89.49 31.23,89.49 IC5.8
  Bottom 0.813: D2.C 16.36,93.13 16.36,92.03 15.5,91.18 C2.1 16.34,90.27 v17.12,89.49 17.64,88.98 R16.2
A1  (via drill 0.5)
  Top 0.254: U$34.2 5.92,86.51 v6.2,86.22 | v13.56,84.67 15.09,83.14 v16.87,83.14
  Bottom 0.254: U$18.5 34.75,46.82 34.14,46.82 21.18,59.78 21.18,61.3 18.9,63.59 18.9,81.87 17.63,83.14 v16.87,83.14 | C33.1 7.96,86.97 9.75,85.18 | v6.2,86.22 6.2,85.68 6.71,85.18 9.75,85.18 | v13.56,84.67 13.06,85.18 10.52,85.18 9.75,85.18
A2  (via drill 0.5)
  Top 0.254: v19.41,109.31 19.62,109.31 U$36.2 | v13.31,98.38 13.31,86.45 15.6,84.16 16.61,84.16 v16.87,84.41
  Bottom 0.254: U$18.6 21.95,59.94 | C32.1 20.04,108.67 v19.41,109.31 13.56,109.31 10.77,106.51 10.77,102.7 13.31,100.16 v13.31,98.38 | 21.95,59.94 21.95,61.55 19.66,63.84 19.66,83.4 18.64,84.41 v16.87,84.41 | 21.95,59.94 22.03,59.86
A3  (via drill 0.5)
  Top 0.254: U$32.2 | 56,111.06 U$32.2 | v40.61,46.31 37.19,46.31 v36.93,46.57 | U$32.2 56.72,109.03 v56.24,108.54 53.7,108.54 51.41,106.26 51.41,102.96 51.92,102.45 58.01,102.45 61.82,98.64 61.82,63.59 62.46,62.95 v62.46,62.19
  Top 0.61: U$32.2 57.27,111.06
  Bottom 0.254: U$18.7 36.93,45.77 v36.93,46.57 | v40.61,46.31 42.77,46.31 44.3,47.84 44.3,59.27 43.54,60.03 43.54,61.3 44.81,62.57 47.85,62.57 49.12,61.3 59.03,61.3 59.79,60.54 61.82,60.54 62.46,61.17 v62.46,62.19 | C31.1 56.88,109.19 v56.24,108.54
A4  (via drill 0.5)
  Top 0.254: v76.3,98.38 77.89,98.38 U$28.2 78.08,89.24 76.81,87.97 66.14,87.97 62.84,84.67 62.84,65.87 63.35,65.36 v63.35,64.86
  Bottom 0.254: U$18.8 37.95,45.32 37.95,47.08 37.19,47.84 37.19,49.36 37.95,50.12 37.95,62.32 39.73,64.09 45.82,64.09 47.09,65.36 50.39,65.36 51.66,64.09 62.59,64.09 v63.35,64.86 | C30.1 77.12,97.56 v76.3,98.38
AVDD  (via drill 0.6, 0.7)
  Top 0.61: v53.7,31.84 53.7,24.72 v53.44,24.22 | v49.89,24.22 49.89,28.79 v49.76,28.91 | v81.38,56.47 64.11,56.47 61.57,53.93 61.57,39.71 63.6,37.68 63.6,34.88 v63.86,34.63
  Bottom 0.254: U$18.36 49.76,29.55 v49.76,28.91 49.76,30.12 U$18.35
  Bottom 0.61: v53.44,24.22 v49.89,24.22 | L7.1 66.98,32.09 64.62,32.09 64.36,32.34 63.35,32.34 | 63.35,32.34 57.51,32.34 56.74,31.58 53.95,31.58 v53.7,31.84 | 81.41,54.33 81.41,56.44 v81.38,56.47 81.38,58.12 C29.1 | v63.86,34.63 63.86,32.85 63.35,32.34
  Bottom 0.813: 81.41,54.33 PAD1.1 | C18.2 81.56,59.45 81.38,59.27 81.38,58.18 C29.1 81.45,58.12
BATTERY(VIN)  (via drill 0.5)
  Top 0.254: v35.92,30.31 35.41,30.82 35.41,43.77 v35.92,44.28
  Bottom 0.254: R7.1 30.67,45.63 26.34,45.63 25.5,44.79 23.97,44.79 R6.2 | U$18.46 36.91,30.31 v35.92,30.31 | C26.1 33.24,45.55 34.65,45.55 v35.92,44.28
  Bottom 0.305: R7.1 C26.1
CHARGER
  Bottom 0.254: 8.6,20.42 8.4,20.43 IC2.BAT
  Bottom 0.813: PTC2.2 10.47,19.18 9.25,20.41 8.82,20.41 8.6,20.42
CP2102-RX  (via drill 0.5)
  Top 0.254: v60.81,36.41 60.3,35.9 60.3,32.85 62.84,30.31 62.84,23.71 65.13,21.42 v65.13,10.5
  Bottom 0.254: U$18.25 50.14,35.39 59.79,35.39 v60.81,36.41 | U2.26 53.7,3.9 53.95,3.64 58.27,3.64 v65.13,10.5
CP2102-TX  (via drill 0.5)
  Top 0.254: v61.19,35.14 60.81,34.88 60.81,33.36 63.35,30.82 63.35,24.22 65.89,21.68 65.89,12.02 v66.4,11.52
  Bottom 0.254: v66.4,11.52 64.87,11.52 57.51,4.15 54.33,4.15 53.82,4.4 U2.25 | U$18.26 50.08,34.88 60.81,34.88 v61.19,35.14
CTS  (via drill 0.41, 0.5)
  Top 0.254: v56.49,7.71 55.47,7.71 53.44,9.74 53.44,12.79 52.93,13.29 52.93,20.91 54.46,22.44 54.46,31.07 55.22,31.84 55.22,33.61 v54.97,33.87
  Bottom 0.254: U$18.27 50.53,33.87 v54.97,33.87 | v56.49,7.71 56.49,5.93 55.73,5.17 54.46,5.17 U2.23
D+
  Bottom 0.254: U$52.D+ 42.01,2.12 42.52,1.61 43.79,1.61 45.06,2.57 47.77,2.63 U2.4
D-
  Bottom 0.254: U$52.D- 42.66,2.49 43.03,2.12 43.66,2.12 44.96,3.08 47.57,3.13 48.62,4.02 U2.5
DC  (via drill 0.5)
  Top 0.254: U$26.P$7 42.39,66.5 41.5,65.62 41.5,61.55 v41.76,61.3 | v36.42,33.87 35.92,34.38 35.92,42.76 37.69,44.54 41.25,44.54 42.27,45.55 42.27,47.84 42.01,48.09 v42.01,49.11
  Bottom 0.254: U$18.48 39.34,33.87 v36.42,33.87 | v42.01,49.11 42.01,61.05 v41.76,61.3
INTERNALBATTERY  (via drill 0.58, 0.7)
  Top 0.813: v28.3,87.72 25.25,84.67 25.25,54.7 19.66,49.11 19.66,39.46 17.63,37.42 17.63,24.22 18.2,23.64 v18.2,21.69 | U$9.OUT\ 13.66,12.88 16.36,15.58 v16.36,16.85
  Bottom 0.813: 12.4,22.18 C34.1 15.26,22.22 PTC2.1 15.53,21.95 17.95,21.95 v18.2,21.69 18.2,17.68 17.37,16.85 v16.36,16.85 | v28.3,87.72 28.3,90.51 27.79,91.02 27.79,92.93 BATTERY.VCC
LED-  (via drill 0.5)
  Top 0.254: v45.57,65.36 45.51,65.42 U$26.P$3 | v24.99,40.98 24.99,49.87 v25.5,50.38 | v30.33,65.11 29.31,64.09 29.31,52.16 29.06,51.9 v29.06,49.11
  Bottom 0.254: v30.33,65.11 30.96,65.74 45.19,65.74 v45.57,65.36 | v24.99,40.98 24.99,39.47 T1.3 | v25.5,50.38 27.79,50.38 v29.06,49.11
LV321  (via drill 0.5)
  Top 0.254: v47.85,71.97 47.85,65.62 44.81,62.57 v44.81,61.05 | v44.81,47.08 44.81,45.81 42.27,43.27 38.46,43.27 v37.69,42.5
  Bottom 0.254: U$18.4 40.03,40.98 39.98,40.98 38.46,42.5 v37.69,42.5 | v47.85,71.97 49.89,74 49.89,84.41 51.41,85.94 62.84,85.94 65.38,88.48 65.38,93.52 | v44.81,61.05 v44.81,47.08 | R31.1 65.38,93.52 | O9U11.4 64.98,93.92 65.38,93.52
MOSI  (via drill 0.5)
  Top 0.254: v40.49,61.05 40.49,65.62 41.5,66.63 41.5,68.37 U$26.P$8 | v37.19,32.85 37.69,33.36 37.69,34.12 36.42,35.39 36.42,42.5 37.95,44.03 42.01,44.03 43.03,45.04 43.03,48.09 v43.16,48.22
  Bottom 0.254: U$18.47 38.88,32.85 v37.19,32.85 | v40.49,61.05 40.49,49.36 42.01,47.84 42.77,47.84 v43.16,48.22
MOTOR-EN
  Bottom 0.813: IC5.9 33.11,92.3 34.65,90.76 48.87,90.76 50.89,88.74 IC5.1 53.53,87.61 R18.1
MOTOR-ON  (via drill 0.5, 0.6)
  Top 0.61: v59.28,14.82 57.25,16.85 57.25,29.8 59.54,32.09 59.54,52.16 57.76,53.93 57.76,95.59 v56.74,96.61
  Bottom 0.61: U$8.OUT2 74.66,12.9 73.51,14.06 60.05,14.06 v59.28,14.82 | IC5.16 55.37,95.23 v56.74,96.61 56.74,97.11 54.66,99.2 C20.2
N$1
  pour Bottom: 69.19,22.18 83.67,22.18 83.67,16.85 69.19,16.85
N$2
  Bottom 0.305: U1.1 21.2,99.16 21.18,99.15
  Bottom 0.813: 21.18,99.15 21.18,98.64 20.8,98.26 20.12,97.57 | 20.12,97.57 19.91,97.37 19.91,94.46 L3.2 | D2.A 20.12,97.57
N$4
  Bottom 0.406: 4.38,20.91 IC2.CE
  Bottom 0.813: R9.1 2.5,31.44 2.13,31.07 2.13,22.18 3.4,20.91 4.38,20.91 4.42,20.91
N$6
  Bottom 0.813: PTC1.1 37.1,13.12 40.74,9.48 JP2.1
N$7
  pour Top (isolate 0.61): -2.35,-1.66 86.08,-2.42 86.08,121.58 -2.35,121.34
N$8  (via drill 0.5)
  Top 0.254: v32.61,31.33 32.36,31.07 32.36,28.79 36.68,24.47 36.93,24.47 v37.06,24.6
  Bottom 0.254: v32.61,31.33 33.12,31.33 33.38,31.58 33.38,32.45 C17.2 | U$18.39 38.46,27.9 38.46,24.98 37.95,24.47 37.19,24.47 v37.06,24.6
N$10  (via drill 0.8)
  other vias: 45.49,36.97
N$11  (via drill 0.7)
  Top 0.813: v20,90.68 14.92,90.68 14.33,91.27 14.33,97.88 15.6,99.15 18.14,99.15 v18.39,98.89
  Bottom 0.254: U1.3 21.2,101.42 20.93,101.69
  Bottom 0.813: R16.1 v20,90.68 20.42,90.26 21.48,90.26 R23.2 | v18.39,98.89 18.39,100.67 19.41,101.69 20.93,101.69
N$12
  Top 0.813: LED3.A R13.1
N$13
  Top 0.813: LED2.A R12.1
N$14
  Bottom 0.254: U$18.37 44.04,32.35 44.04,25.74 45.08,24.71 U$4.OSC2 45.5,24.97 C16.2
N$15
  Bottom 0.406: U3.1 9.37,45.02 9.37,45.01
  Bottom 0.813: D3.A 9.89,36.37 8.36,37.9 8.36,40.25 L4.2 8.36,40.59 8.36,42.73 9.37,43.74 9.37,45.01
N$16
  Top 0.813: LED1.A R10.1
N$17  (via drill 0.5)
  Top 0.254: v59.28,28.03 59.79,28.03 60.3,27.52 60.3,24.52 v60.74,24.09
  Bottom 0.254: L2.2 v60.74,24.09 72.68,24.09 C23.2 | U$18.32 53.55,28.03 v59.28,28.03
N$18  (via drill 0.5)
  Top 0.254: v59.28,25.23 58.01,26.5 58.01,28.53 v58.52,29.04
  Bottom 0.254: U$18.31 53.1,29.04 v58.52,29.04 | 68.5,27.78 L1.2 | 68.11,26.5 68.21,26.41 | v59.28,25.23 68.35,25.23 68.86,25.75
  Bottom 0.406: L1.2 68.21,26.41 68.86,25.75 69.64,25.75 L2.1
N$19
  Bottom 0.406: U3.3 9.26,47.16 9.12,47.3
  Bottom 0.813: R11.1 4.55,44.59 4.55,45.78 4.13,46.2 R4.2 4.13,48.91 4.8,49.59 7.6,49.59 9.12,48.06 9.12,47.3
N$20
  Bottom 0.254: C24.1 C23.1 72.21,25.75 71.66,25.75 71.22,26.18 L5.1
N$21
  Bottom 0.254: C25.1 71.85,31.12 71.4,30.67 71.4,29.95 L5.2
  Bottom 0.406: C25.1 C28.1
  Bottom 0.813: C28.1 73.05,34.42 U$40.P$2
N$22  (via drill 0.6)
  Top 0.508: IC5.3 45.82,87.6 45.82,85.43 45.06,84.67 28.3,84.67 27.03,83.4 27.03,53.93 23.98,50.89 23.98,39.71 28.8,34.88 v28.8,27.01
  Bottom 0.508: MOTOR2.1 28.74,26.06 v28.8,27.01
N$23
  Bottom 0.254: U$18.30 52.43,30.27 C19.2 66.69,30.27 67.16,29.8 68.17,29.8 L1.1
N$24
  Bottom 0.254: U$18.38 43.54,32.41 43.54,28.03 42.73,27.22 U$4.OSC1 40,27 C15.2
N$25  (via drill 0.5)
  Top 0.254: v60.55,31.33 62.33,29.55 62.33,24.22 61.32,23.2 59.28,23.2 v58.52,23.96
  Bottom 0.254: U$18.29 51.94,31.33 51.94,31.3 52.43,30.82 60.05,30.82 v60.55,31.33 | C22.2 57.84,20.74 58.52,21.42 v58.52,23.96
N$26  (via drill 0.5)
  Top 0.254: v53.7,40.22 53.95,40.47 53.95,42 52.93,43.01 45.57,43.01 44.04,41.49 40.23,41.49 39.47,40.73 v39.47,38.95
  Bottom 0.254: U$18.2 40.93,38.95 v39.47,38.95 | L6.2 64.87,38.77 63.43,40.22 v53.7,40.22
N$27
  Bottom 0.406: L6.1 L7.2
N$28  (via drill 0.6)
  Top 0.508: IC5.6 38.2,87.6 38.2,86.19 37.69,85.68 27.79,85.68 26.26,84.16 26.26,54.19 23.22,51.14 23.22,38.95 27.28,34.88 v27.28,27.01
  Bottom 0.508: MOTOR2.2 26.26,13.8 27.79,15.33 27.79,26.5 v27.28,27.01
N$29
  Top 0.813: LED4.A R1.1
N$30  (via drill 0.5)
  Top 0.254: v21.95,36.92 22.45,37.42 22.45,47.84 v22.2,48.09 | v41,70.7 41,71.8 R17.2 | v22.71,55.97 23.22,56.47 23.22,67.4 v22.71,67.9
  Bottom 0.254: T1.1 22.72,37.69 v21.95,36.92 | v41,70.7 41,68.92 39.47,67.4 23.22,67.4 v22.71,67.9 | v22.2,48.09 22.71,48.6 v22.71,55.97
N$31
  Top 0.813: LED9.A R32.1
N$32
  Top 0.508: MOTOR1.2 55.26,16.13 56.49,17.36 56.49,30.31 58.78,32.6 58.78,51.65 57,53.43 57,94.32 52.68,98.64 40.23,98.64 38.2,96.61 38.2,95.24 IC5.11
N$33
  Top 0.813: LED8.A R27.1
N$34
  Bottom 0.254: U1.4 24.05,101.37 24.23,101.56
  Bottom 0.813: 24.23,101.56 27.03,101.56 R25.1
N$35  (via drill 0.5)
  Top 0.508: v53.95,14.06 54.46,14.82 54.46,16.6 55.73,17.87 55.73,30.57 58.01,32.85 58.01,50.89 56.24,52.66 56.24,93.81 52.43,97.62 48.2,97.62 IC5.14 45.82,95.24
  Bottom 0.508: MOTOR1.1 57.74,13.06 56.74,14.06 v53.95,14.06
N$36
  Top 0.813: LED5.A R24.1
N$37
  Bottom 0.254: U3.4 11.97,47.46 12.1,47.6
  Bottom 0.813: R26.1 16.78,44.91 17.44,45.57 17.44,49.12 14.9,51.66 12.87,51.66 12.1,50.9 12.1,47.6
N$38  (via drill 0.5, 0.6, 0.7)
  Top 0.254: 81.62,98.2 U$28.4 | 57.91,114.41 57.91,114.25 U$32.4 | U$36.4 18.68,111.67 18.45,111.44 | U$26.P$12 38.44,67.41 38.46,67.4
  Top 0.406: v62.08,100.67 65.38,100.67 v66.14,99.91 | U$26.P$5 43.95,73.33 | 43.95,73.33 42.52,74.76 38.96,74.76 v38.65,74.45 | U$26.P$2 46.29,71.75 45.31,72.73 44.55,72.73 43.95,73.33 | U$26.P$13 37.66,66.67 38.08,66.25 38.46,66.63 38.46,67.4 38.46,69.68 37.95,70.19 37.95,69.94 37.66,69.65 U$26.P$13
  Top 0.813: v6.96,46.03 13.67,46.03 v16.68,43.03 16.36,42.71 16.36,18.63 17.63,17.36 17.63,14.31 20.42,11.52 22.2,11.52 25.25,14.56 31.6,14.56 33.12,13.04 38.2,13.04 | U$6.19 75.38,85.45 76.05,84.78 79.05,84.78 U$27.2 80.3,82.82 79.1,81.62 79.1,76.29 v79.6,75.78 80.37,75.78 81.64,74.51 81.64,70.21 U$19.4 | 62.83,33.11 v70.13,33.11 | v31.34,34.38 30.58,33.61 30.58,27.52 v31.22,26.88 33,26.88 v35.92,23.96 | v18.26,60.66 14.83,57.24 v3.66,57.24 2.37,58.53 2.37,62.63 arc-180 U$20.4 | v37.44,9.48 37.44,12.02 38.33,12.91 38.2,13.04 | PORTB/C1.12 PORTB/C1.11 | LED4.C LED1.C LED2.C | LED2.C LED3.C | LED5.C LED10.C LED2.C | LED5.C LED8.C LED9.C | v46.33,58.51 46.33,56.64 LED5.C | RST.2 4.67,81.7 4.67,86.19 v2.9,87.97 2.37,88.5 2.37,90.63 U$34.4 | v6.45,102.45 13.56,109.56 v17.56,111.1 | 19.6,111.9 19.16,111.9 18.85,111.59 18.45,111.44 v17.56,111.1 | 81.62,98.2 81.62,100.68 80.87,101.43 v78.59,101.43 77.32,101.43 69.95,108.8 64.11,108.8 v63.09,109.81 60.55,109.81 59.28,111.08 59.28,112.1 57.91,113.47 57.91,114.41 57.68,114.64 31.85,114.64 v27.79,110.58 28.04,110.32 v31.6,110.32 | 38.08,66.25 38.08,57.05 LED2.C | v51.41,5.93 v51.41,12.53 v51.41,17.1 | 62.83,33.11 62.33,33.61 62.33,37.42 60.55,39.2 60.55,54.44 64.11,58 v77.83,58 | 62.83,33.11 64.36,31.58 64.36,29.55 | 64.36,29.55 64.36,26.25 66.89,23.72 v76.29,23.72 | v66.65,28.53 65.38,28.53 64.36,29.55 | v19.91,100.42 28.04,100.42 29.06,99.4 29.06,94.74 BATTERY.S | v17.56,111.1 18.13,111.67 U$36.4 | v38.65,74.45 37.95,73.75 37.95,70.19 | IC5.4 43.27,89.25 42.52,90 33.38,90 31.09,92.29 31.09,97.11 32.36,98.38 v35.66,98.38 | JP2.2 43.27,10.77 41,13.04 38.2,13.04
  Bottom 0.254: U$18.13 46.19,41 46.08,41.11 | U$18.33 51.42,29.58 51.42,29.26 51.18,29.26 U$18.34 | U2.3 v51.41,5.93 | 40.23,5.17 40.36,5.17 U$52.GND | U2.EXP U2.M
  Bottom 0.305: U3.2 9.32,46.16 8.74,46.16 | 20.68,100.41 20.68,100.42 U1.2 20.55,100.42 | 40.36,5.07 v40.26,4.99 | IC2.GND 7.09,26.07
  Bottom 0.406: 7.09,26.07 7.09,26.98 | O9U11.2 64.03,99.32 64.62,99.91 v66.14,99.91 | v62.08,100.67 62.08,101.25 | 62.33,101.12 R30.2
  Bottom 0.61: 51.42,29.26 51.66,29.02 51.66,26.67 | 70.24,34.51 C28.2 | R7.2 30.89,44.04 | 4.29,26.47 4.29,26.32 IC2.TEMP
  Bottom 0.813: v27.79,110.58 26.37,109.15 C32.2 25.31,109.24 24.23,110.32 20.59,110.32 U$36.4 18.13,111.67 v17.56,111.1 | R4.1 6.96,46.28 v6.96,46.03 | 8.74,46.16 7.09,46.16 arc90 v6.96,46.03 | v31.6,110.32 31.6,108.29 33.2,106.69 PORTB/C1.11 | 20.42,86.19 16.52,86.19 15.5,87.21 | 20.42,86.19 21.5,87.27 R23.1 | 20.55,100.42 v19.91,100.42 | C12.2 v16.68,43.03 17.69,43.03 18.96,44.3 18.96,59.97 v18.26,60.66 16.61,62.32 16.61,81.37 15.5,82.48 15.5,87.21 | 16.66,29.81 IC3.1 15.18,31.29 C13.2 | 16.66,29.81 17.65,28.82 C40.2 17.65,26.73 18.64,25.74 21.95,25.74 24.99,28.79 27.03,28.79 | 16.68,29.82 16.66,29.81 | U$4.1 47.64,27 C16.1 51.66,26.67 58.52,26.67 | 58.52,26.67 60.47,26.67 62.33,28.53 v66.65,28.53 66.1,28.57 C19.1 | C18.1 81.39,62.82 79.6,62.82 78.59,63.84 | C15.1 39.78,22.89 40.74,21.93 | 40.74,21.93 49.12,21.93 49.63,22.44 54.29,22.44 55.26,23.41 | 30.72,41.35 31.85,40.22 34.14,40.22 35.15,39.2 35.15,37.17 34.65,36.66 33.59,36.66 C10.2 C17.1 33.4,34.38 v31.34,34.38 | 30.72,41.35 R7.2 C26.2 | 46.08,41.11 46.08,44.03 46.35,44.3 C27.2 46.35,45.53 46.33,45.55 | 58.52,26.67 56.91,25.06 | 56.91,25.06 55.26,23.41 | 78.59,70.7 77.76,71.53 R2.1 | 78.59,70.7 78.59,63.84 | 78.59,63.84 78.59,58.76 v77.83,58 79.56,58 C29.2 | 78.59,70.7 78.59,74.76 v79.6,75.78 | U$27.2 81.01,85.3 78.59,87.72 78.59,92.8 77.92,93.46 | 77.92,93.46 77.99,93.46 78.59,94.07 v78.59,101.43 | v3.66,57.24 5.44,57.24 6.45,58.25 6.45,76.56 RST.2 | C2.2 15.5,87.21 | 20.42,86.19 24.74,86.19 26.5,87.95 BATTERY.GND 26.5,95.82 27.03,96.35 28.04,96.35 arc-54 29.04,95.84 | v40.26,4.99 40.23,5.67 38.71,7.2 | 38.71,7.2 33.38,7.2 31.6,5.42 D1.A 30.33,5.24 30.33,3.9 31.94,2.28 C1.2
  Bottom 0.813: v37.44,9.48 37.44,8.47 38.71,7.2 | 70.05,34.52 C28.2 70.15,33.13 v70.13,33.11 70.09,33.07 70.09,31.98 C25.2 | v2.9,87.97 2.93,88 C33.2 6.45,88.19 v6.45,102.45 | 46.33,45.4 46.33,45.55 | 46.33,45.55 v46.33,58.51 | 11.03,31.27 C13.2 | 4.29,26.47 3.53,27.23 3.53,30.54 4.29,31.3 5.68,31.3 R14.2 5.73,31.29 8.61,31.29 | C13.2 8.61,31.29 | 7.09,26.98 7.09,29.01 8.36,30.28 8.36,31.04 8.61,31.29 | 62.14,108.54 62.14,108.86 v63.09,109.81 | C24.2 76.18,23.83 v76.29,23.72 | C22.1 56.91,22.54 56.91,25.06 | 40.36,5.07 40.33,5.07 40.23,5.17 | 55.26,23.41 55.26,18.67 53.7,17.1 v51.41,17.1 | U2.EXP 51.41,6.37 v51.41,5.93 | C30.2 77.92,93.46 | C31.2 61.97,108.71 62.14,108.54 | v6.96,46.03 6.96,44.79 6.2,44.03 6.2,40.98 5.49,40.27 C14.2 | C6.2 17.45,38.77 18.39,39.71 19.91,39.71 20.93,40.73 22.33,40.73 T1.2 22.72,41.75 23.47,42.5 29.57,42.5 30.72,41.35 | C4.2 49.84,10.96 v51.41,12.53 | 29.06,96.1 29.06,94.74 BATTERY.S 29.04,95.84 | C3.2 29.04,97.66 29.04,95.84 | IC5.4 IC5.5 41,87.35 41,85.18 38.65,82.83 v38.65,74.45 | IC5.13 IC5.12 40.74,95.24 40.74,98.13 40.23,98.64 37.95,98.64 35.65,100.94 35.65,101.43 | C20.1 43.56,95.52 IC5.13 | PORTB/C1.12 35.65,101.43 | v35.66,98.38 35.66,101.42 35.65,101.43 | 62.14,108.54 R30.2 62.08,101.25 | v35.92,23.96 37.95,21.93 40.74,21.93 | 27.03,28.79 28.3,28.79 29.57,28.79 31.22,27.14 v31.22,26.88 | IC5.13 43.28,95.22 43.28,92.8 44.04,92.03 50.14,92.03 51.66,90.51 53.9,90.51 R29.1 | C34.2 16.65,23.92 17.37,23.2 24.74,23.2 25.76,24.22 25.76,27.52 27.03,28.79
N$39
  Bottom 0.406: O9U11.3 66.75,98.23 | 66.75,98.23 68.52,98.23 R28.2 | 66.75,98.23 65.38,96.86 62.33,96.86 57.84,92.37 R29.2 54.2,92.32 54.2,92.54
N$40
  Top 0.813: LED10.A R19.1
N$41
  Bottom 0.813: PTC1.2 34.52,10.12 31.73,10.12 29.31,7.71 26.26,7.71 25.5,6.94 25.5,5.77 D1.C 25.6,5.67 22.45,5.67 19.15,8.98 17.37,8.98 15.09,11.26 11.53,13.29 U$9.IN
N$42
  Bottom 0.406: O9U11.1 63.08,99.64 63.86,100.42 63.86,101.3 R30.1
  Bottom 0.61: R15.2 70.37,101.6 71.98,103.21 71.98,106.26 69.19,109.05 64.87,109.05 63.84,108.02 R30.1
N$43
  Bottom 0.813: T2.1 33.45,17.62 R3.2
N$44
  Bottom 0.61: IC2.STDBY 7.13,18.45 7.47,18.12 8.35,18.12 R21.2
N$45
  Bottom 0.61: IC2.PROG 5.87,28.71 5.56,29.01 5.56,29.43 R14.1
N$47  (via drill 0.5, 0.6, 0.7)
  Top 0.508: v30.33,12.79 29.82,13.29 25.25,13.29 22.45,10.5 19.41,10.5 v18.14,11.77 | v48.36,13.29 48.36,11.61 LED6.C
  Bottom 0.508: v30.33,12.79 30.84,12.79 33.12,15.07 38.71,15.07 39.98,13.8 47.85,13.8 v48.36,13.29
  Bottom 0.61: R22.1 5.71,15.06 6.45,14.31 13.61,14.31 15,12.92 16.98,12.92 v18.14,11.77
N$48
  Bottom 0.61: IC2.CHRG 5.87,17.92 R22.2
N$49  (via drill 0.7)
  Top 0.61: v24.49,8.98 24.99,8.47 30.07,8.47 33.08,11.47 LED7.C
  Bottom 0.61: R21.1 13.1,16.32 15.37,14.06 18.39,14.06 23.47,8.98 v24.49,8.98
PORTB1  (via drill 0.5)
  Top 0.254: v60.6,62.54 60.55,97.88 57,101.43 51.16,101.43 50.14,102.45 50.14,107.27 49.12,108.29 44.04,108.29 43.28,107.53 43.28,106.7 PORTB/C1.5 | v38.46,48.73 35.53,48.73 34.65,49.62 34.65,50.43 R10.2
  Bottom 0.254: U$18.9 38.46,45.38 v38.46,48.73 38.46,61.81 40.23,63.59 48.36,63.59 49.38,62.57 60.33,62.57 v60.6,62.54
PORTB2  (via drill 0.5)
  Top 0.254: PORTB/C1.7 40.73,107.27 42.26,108.8 49.38,108.8 50.9,107.27 50.9,102.7 51.66,101.94 57.51,101.94 61.32,98.13 61.32,63.33 61.57,63.08 61.57,61.78 v61.24,61.45 | R12.2 37.5,50.32 39.28,50.32 39.47,50.12 39.47,49.11 v39.73,48.85
  Bottom 0.254: U$18.10 38.96,45.44 38.96,47.58 39.73,48.35 v39.73,48.85 38.96,49.62 38.96,61.05 41,63.08 48.11,63.08 49.12,62.06 59.28,62.06 60.05,61.3 61.09,61.3 v61.24,61.45
PORTB3  (via drill 0.5, 0.6)
  Top 0.254: v35.41,29.3 34.65,30.06 34.65,45.81 | R13.2 40.74,50.33 40.74,48.35 41.76,47.33 41.76,46.06 41,45.3 35.15,45.3 34.65,45.81 | 34.65,45.81 33.63,46.82 28.3,46.82 27.53,47.58 27.53,52.16 28.3,52.92 28.3,81.87 v29.31,82.89 | v33.63,108.8 32.11,107.27 v32.11,104.48
  Bottom 0.254: U$18.45 36.46,29.3 v35.41,29.3 | PORTB/C1.9 38.2,106.7 38.2,108.54 37.69,109.05 33.88,109.05 v33.63,108.8 | v32.11,104.48 33.12,103.46 33.12,99.4 30.33,96.61 30.33,83.91 v29.31,82.89
PORTB4  (via drill 0.5)
  Top 0.254: v40.23,47.58 33.12,47.58 | 33.12,47.58 31.5,49.21 R1.2 | 33.12,47.58 32.87,47.33 28.8,47.33 28.04,48.09 28.04,51.65 28.8,52.41 28.8,80.35 v31.09,82.64 | v33.88,105.24 33.88,107.53 34.9,108.54 v39.47,108.54
  Bottom 0.254: U$18.11 39.47,45.5 39.47,47.08 39.98,47.58 v40.23,47.58 | PORTB/C1.3 45.82,106.7 45.82,107.78 45.06,108.54 v39.47,108.54 | v33.88,105.24 33.88,99.15 31.34,96.61 31.34,82.89 v31.09,82.64
PORTC1  (via drill 0.5)
  Top 0.254: v58.78,54.44 60.3,55.97 60.3,58.76 60.81,59.27 60.81,60.28 59.79,61.3 59.79,97.62 56.74,100.67 51.16,100.67 49.63,102.19 46.58,102.19 45.81,102.97 PORTB/C1.4 | R19.2 44.61,50.57 46.08,49.11 46.08,46.06 48.11,44.03 v48.36,44.03
  Bottom 0.254: v58.78,54.44 58.78,52.74 53.11,47.08 50.14,47.08 48.36,45.3 v48.36,44.03 48.36,42.33 U$18.14
PORTC2  (via drill 0.5)
  Top 0.254: v58.78,55.97 59.16,55.97 59.66,56.47 59.66,58.89 60.3,59.52 60.3,60.03 59.28,61.05 59.28,97.11 56.24,100.16 50.9,100.16 49.38,101.69 45.57,101.69 43.27,103.98 PORTB/C1.6 | R24.2 46.5,49.45 46.71,49.23 46.71,46.31 48.13,44.89 v49.73,44.89
  Bottom 0.254: U$18.15 51.49,44.89 | v58.78,55.97 60.3,54.44 60.3,53.68 59.81,53.19 59.79,53.19 51.78,45.18 51.49,44.89 | v49.73,44.89 51.49,44.89
PORTC3  (via drill 0.5)
  Top 0.254: PORTB/C1.8 40.74,104.14 40.74,103.72 42.27,102.19 44.3,102.19 45.31,101.18 48.87,101.18 50.39,99.65 55.73,99.65 58.52,96.86 58.52,60.28 v59.03,59.78 58.78,59.52 v58.78,57.24 | R27.2 49.5,49.75 49.89,49.36 53.19,49.36 v53.7,48.85
  Bottom 0.254: U$18.16 61.06,53.9 61.06,54.95 v58.78,57.24 | v53.7,48.85 53.7,50.38 54.2,50.89 55.22,50.89 57,52.66 57,58.25 58.52,59.78 v59.03,59.78
PORTC4  (via drill 0.41, 0.5)
  Top 0.254: R32.2 53.76,50.57 v54.46,49.87 | v52.93,103.46 57.76,103.46 62.33,98.89 62.33,64.35 63.6,63.08 63.6,61.05 62.08,59.52 v61.82,59.52
  Bottom 0.254: U$18.17 61.82,54.09 v61.82,59.52 60.81,59.52 60.05,58.76 58.52,58.76 57.51,57.74 57.51,52.41 54.97,49.87 v54.46,49.87 | PORTB/C1.10 38.19,102.71 38.96,101.94 49.12,101.94 50.65,103.46 v52.93,103.46
PORTF1  (via drill 0.5)
  Top 0.254: U$20.2 6.02,59.45 6.96,58.51 13.56,58.51 v20.8,65.74
  Bottom 0.254: U$18.18 63.09,54.8 63.09,60.79 66.4,64.09 66.4,65.87 65.89,66.38 21.44,66.38 v20.8,65.74
PORTF2  (via drill 0.5)
  Top 0.254: 2.56,69.94 2.37,70.13 2.42,70.19 2.64,70.19 3.4,70.19 5.44,68.16 12.29,68.16 13.44,67.01 v20.8,67.01
  Top 0.813: U$20.3 2.62,70.16 2.64,70.19
  Bottom 0.254: U$18.19 63.6,54.74 63.6,57.24 | v20.8,67.01 20.93,66.89 66.14,66.89 66.9,66.13 66.9,63.84 65.89,62.82
  Bottom 0.305: 63.6,57.24 63.6,60.54 65.89,62.82
PORTG1  (via drill 0.5)
  Top 0.254: U$19.2 78.33,69.86 78.33,63.08 75.79,60.54 68.17,60.54 67.67,61.05 v65.38,61.05
  Bottom 0.254: U$18.20 64.36,54.94 64.36,60.03 v65.38,61.05
PORTG2  (via drill 0.5)
  Top 0.254: 81.64,62.71 81.49,62.57 78.84,62.57 76.05,59.78 v65.89,59.78
  Top 0.813: 81.49,62.57 81.49,62.6 U$19.3
  Bottom 0.254: U$18.21 65.63,55.64 65.63,59.52 v65.89,59.78
PORTM1  (via drill 0.5)
  Top 0.254: v49.38,71.97 48.36,70.95 48.36,65.36 46.08,63.08 v46.08,61.3 | v47.6,48.85 47.6,46.57 48.36,45.81 53.19,45.81 53.7,45.3 53.7,43.01 54.71,42 54.71,37.42 50.9,33.61 50.9,23.71 50.39,23.2 39.98,23.2 37.57,25.61 v37.57,25.74 | IC5.2 48.35,86.46 49.38,85.43 51.41,85.43 v51.92,84.92
  Bottom 0.254: v49.38,71.97 50.9,73.49 50.9,83.91 v51.92,84.92 | U$18.40 37.57,27.57 v37.57,25.74 | v47.6,48.85 47.6,59.78 v46.08,61.3
PORTM2  (via drill 0.5)
  Top 0.254: v34.9,82.89 33.88,83.91 28.55,83.91 27.79,83.14 27.79,53.43 27.03,52.66 27.03,47.33 28.04,46.31 33.12,46.31 33.88,45.55 33.88,29.04 36.42,26.5 v36.42,25.99
  Bottom 0.254: U$18.41 36.42,27 v36.42,25.99 | IC5.7 35.65,83.64 v34.9,82.89
PORTM3  (via drill 0.5)
  Top 0.254: v53.95,20.66 54.46,20.66 54.97,21.17 54.97,30.82 57.25,33.11 57.25,50.63 55.47,52.41 55.47,93.3 51.92,96.86 49.38,96.86 48.35,95.83 IC5.15
  Bottom 0.254: U$18.42 34.39,25.53 34.39,23.71 37.19,20.91 53.7,20.91 v53.95,20.66
PORTM4  (via drill 0.5)
  Top 0.254: v53.7,74.25 54.97,75.52 54.97,86.45 50.65,90.76 36.42,90.76 35.65,91.54 IC5.10 | v49.38,68.16 49.38,65.62 49.63,65.36 v49.63,60.03 | v50.39,48.09 51.41,47.08 53.95,47.08 54.71,46.31 54.71,43.52 55.73,42.5 55.73,36.66 51.92,32.85 51.92,22.44 51.41,21.93 35.66,21.93 33.38,24.22 v32.87,24.22
  Bottom 0.254: v49.38,68.16 53.19,68.16 54.2,69.17 54.2,73.75 v53.7,74.25 | U$18.43 32.87,24.57 v32.87,24.22 | v49.63,60.03 49.63,48.85 v50.39,48.09
PROG1  (via drill 0.5)
  Top 0.254: v48.62,47.84 48.62,47.58 49.63,46.57 53.7,46.57 54.2,46.06 54.2,43.27 55.22,42.25 55.22,37.17 51.41,33.36 51.41,23.2 50.65,22.44 35.92,22.44 32.87,25.49 v32.61,25.49 | v65.38,64.6 65.38,64.86 63.86,66.38 63.86,83.65 64.62,84.41 73.97,84.41 v74.75,83.64 | v47.35,61.55 47.35,62.82 v48.74,64.35
  Bottom 0.254: U$27.1 80.97,79.84 79.1,79.84 78.5,80.44 R8.1 78.45,81.62 77.06,81.62 76.56,82.13 76.56,83.14 76.06,83.64 v74.75,83.64 | U$18.44 33.22,25.49 v32.61,25.49 | v65.38,64.6 64.36,63.59 49.89,63.59 49,64.35 v48.74,64.35 | v48.62,47.84 48.62,60.28 v47.35,61.55
RST  (via drill 0.48, 0.5)
  Top 0.254: v20.93,82.13 14.96,82.13 v13.82,83.27 | v33.38,81.11 34.9,81.11 37.69,83.91 v53.19,83.91
  Bottom 0.254: RST.1 6.17,82.94 R5.1 13.06,83.27 v13.82,83.27 | v20.93,82.13 21.44,82.13 21.95,81.62 32.87,81.62 v33.38,81.11 | U$18.23 52.87,41.74 54.71,41.74 56.49,43.52 56.49,45.81 67.67,56.98 67.67,66.13 65.63,68.16 56.24,68.16 55.47,68.92 55.47,76.54 54.46,77.56 53.19,77.56 51.92,78.83 51.92,82.64 v53.19,83.91 54.71,85.43 63.35,85.43 64.62,86.7 U$6.1
RTS  (via drill 0.41, 0.5)
  Top 0.254: v57.25,6.69 55.73,6.69 52.93,9.48 52.93,12.53 52.43,13.04 52.43,32.6 56.24,36.41 56.24,43.52 v55.6,44.15
  Bottom 0.254: U$18.22 53.57,43.01 54.46,43.01 v55.6,44.15 | v57.25,6.69 57.25,5.42 56.49,4.66 54.33,4.66 U2.24
SCLK  (via drill 0.5)
  Top 0.254: v52.43,48.35 52.68,48.35 53.19,47.84 55.73,47.84 56.74,46.82 56.74,33.87 v56.24,33.36 | U$26.P$9 40.78,67.18 39.47,65.87 39.47,60.03 40.23,59.27 45.31,59.27 45.57,59.52 48.87,59.52 49.63,58.76 v51.16,58.76
  Bottom 0.254: U$18.28 50.98,32.85 55.73,32.85 v56.24,33.36 | v52.43,48.35 52.17,48.35 50.39,50.12 50.39,58 v51.16,58.76
SWDCLK  (via drill 0.5)
  Top 0.254: v68.68,61.55 66.9,61.55 64.36,64.09 64.36,65.11 63.35,66.13 63.35,84.41 64.38,85.45 U$6.2
  Bottom 0.254: v68.68,61.55 68.68,59.01 | 68.68,59.01 68.68,57.24 57,45.55 57,43.01 55.22,41.23 52.92,41.23 U$18.24 | R2.2 76.02,68.44 77.32,67.14 77.32,61.3 76.3,60.28 69.95,60.28 68.68,59.01
TFT  (via drill 0.5)
  Top 0.254: U$26.P$6 43.17,65.22 43.18,65.22 v43.18,64.96 | v32.11,64.6 31.34,64.6 30.07,63.33 30.07,49.11 v30.58,48.6 | v26.01,47.84 26.01,47.33 27.53,45.81 32.87,45.81 33.38,45.3 33.38,42.5 v32.87,42
  Top 0.406: U$26.P$6 43.17,71.32 R17.1
  Bottom 0.254: U$18.3 40.48,39.96 35.92,39.96 33.88,42 v32.87,42 | v32.11,64.6 32.36,64.86 43.18,64.86 v43.18,64.96 | v30.58,48.6 29.82,47.84 v26.01,47.84
VCC/2  (via drill 0.6, 0.8)
  Top 0.813: v35.15,5.42 35.5,5.77 | 35.5,5.77 LED7.A | 35.5,5.77 36.93,7.2 38.96,7.2 39.98,6.18 43.03,6.18 v43.79,5.42 44.52,6.39 45.31,7.45 46.58,7.45 LED6.A 49.52,9.37 50.14,9.99 50.14,18.63 47.85,20.91 36.68,20.91 | v2.64,35.65 2.64,33.61 4.67,31.58 9.06,31.58 C13.1 v11.05,27.04 v11.02,27.01 | v35.41,19.64 36.68,20.91 | v23.47,24.72 29.06,24.72 32.87,20.91 36.68,20.91
  Bottom 0.406: IC2.VCC 8.71,26.02 8.74,25.99 8.87,25.99 | U$52.VUSB 43.4,4.91 43.54,4.91
  Bottom 0.813: T2.3 34.29,21.52 35.35,20.46 R3.1 35.35,19.59 v35.41,19.64 | C1.1 v35.15,5.42 | 43.54,4.91 43.79,5.17 v43.79,5.42 | 8.87,25.99 10.01,25.99 v11.02,27.01 11.02,29.56 C13.1 | R9.2 2.5,35.5 v2.64,35.65 | v11.05,27.04 14.3,27.04 16.1,25.23 17.12,25.23 17.88,24.47 23.22,24.47 v23.47,24.72

### Text on the board
Top: TOP
Bottom: www.bibox.in | BIHBSKV.4.1 | 13/JUNE/2018 | BOTTOM
tNames: B1 | B2 | B3 | B4 | C1 | C2 | C3 | C4